# Altium project radxa_cm3_io_board_v1330.PrjPcb (part 3 of 4)

## Sheet 14.SchDoc
size 297 x 209 mm
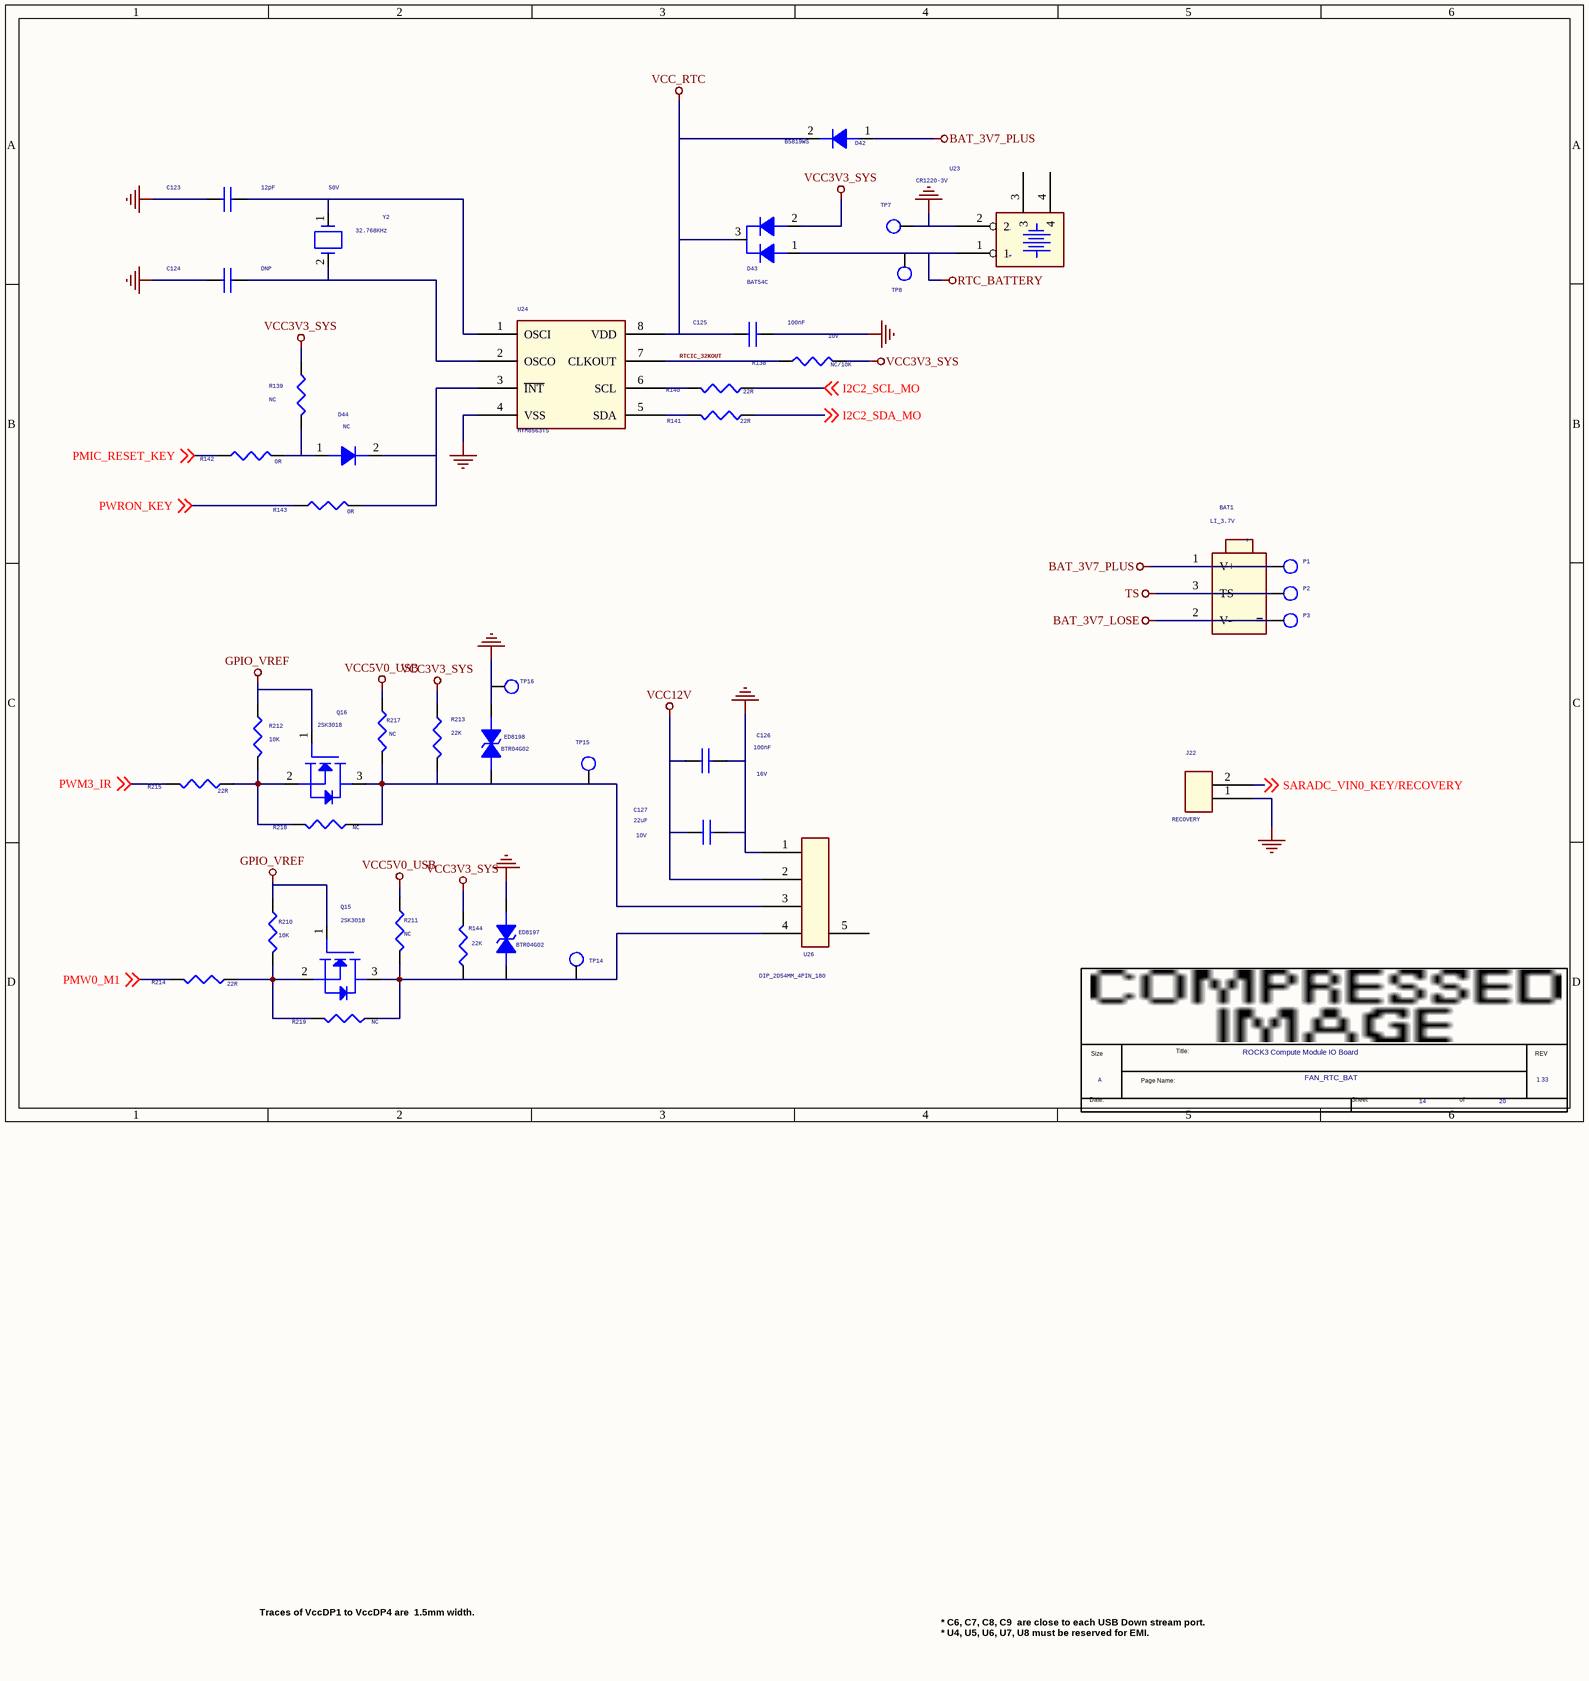
[diagram p12: 14.SchDoc]

### Parts
(Parts that share a designator on the sheet are numbered #1, #2 ... from top to bottom, then left to right.)
*#13  Page Count: 20  Page Number: 14  Page Size: A  Title: ROCK3 Compute Module IO Board  RevCode: 1.33  Doc: FAN_RTC_BAT  (hidden comment: radxa_1010)  (graphical)
BAT1  LI_3.7V  [SMD-3P-1.25]
C123  12pF  Voltage: 50V  [C0402]
C124  DNP  [C0402]
C125  100nF  Voltage: 10V  [C0402]
C126  100nF  Voltage: 16V  [C0402]
C127  22uF  Voltage: 10V  [C0603]
D42  B5819WS  [SOD_323]
D43  BAT54C  [SOT_23]
D44  NC  [SOD323]
ED8197  BTR04G02  [ESD0402_1xD5]
ED8198  BTR04G02  [ESD0402_1xD5]
J22  RECOVERY  [DIP2PIN-2P54MM]
P1  TEST  [TEST]  (value not drawn)
P2  TEST  [TEST]  (value not drawn)
P3  TEST  [TEST]  (value not drawn)
Q15  2SK3018  [SOT23]
Q16  2SK3018  [SOT23]
R138  NC/10K  [R0402]
R139  NC  [R0402]
R140  22R  [R0402]
R141  22R  [R0402]
R142  0R  [R0402]
R143  0R  [R0402]
R144  22K  [R0402]
R210  10K  [R0402]
R211  NC  [R0402]
R212  10K  [R0402]
R213  22K  [R0402]
R214  22R  [R0402]
R215  22R  [R0402]
R217  NC  [R0402]
R218  NC  [R0402]
R219  NC  [R0402]
TP7  TP_0.7  [TEST]  (value not drawn)
TP8  TP_0.7  [TEST]  (value not drawn)
TP14  TP_1.0  [TEST]  (value not drawn)
TP15  TP_1.0  [TEST]  (value not drawn)
TP16  TP_1.0  [TEST]  (value not drawn)
U23  CR1220-3V  [BATTERY-20MM]
U24  HYM8563TS  [MSOP8]
U26  DIP_2D54MM_4PIN_180  [470531000_4PIN]
Y2  32.768KHz  [CRY-3215]

### Nets
BAT_3V7_LOSE: BAT1.2(V-) P3.1
BAT_3V7_PLUS: BAT1.1(V+) D42.1(A) P1.1
GND: C123.2 C124.2 C125.2 C126.2 C127.2 ED8197.1 ED8198.1 J22.1 TP7.1 TP16.1 U23.2 U24.4(VSS) U26.1
GPIO_VREF: Q15.1(GATE) Q16.1(GATE) R210.1 R212.1
RTC_BATTERY: D43.1(A1) TP8.1 U23.1
TS: BAT1.3(TS) P2.1
VCC3V3_SYS: D43.2(A2) R138.2 R139.1 R144.1 R213.1
VCC5V0_USB: R211.1 R217.1
VCC12V: C126.1 C127.1 U26.2
VCC_RTC: C125.1 D42.2(K) D43.3(K) U24.8(VDD)
I2C2_SCL_MO: R140.1 ; off-sheet I2C2_SCL_MO
I2C2_SDA_MO: R141.1 ; off-sheet I2C2_SDA_MO
PMIC_RESET_KEY: R142.1 ; off-sheet PMIC_RESET_KEY
PMW0_M1: R214.2 ; off-sheet PMW0_M1
PWM3_IR: R215.2 ; off-sheet PWM3_IR
PWRON_KEY: R143.1 ; off-sheet PWRON_KEY
RTCIC_32KOUT: R138.1 U24.7(CLKOUT)
SARADC_VIN0_KEY/RECOVERY: J22.2 ; off-sheet SARADC_VIN0_KEY/RECOVERY
NetC123_1: C123.1 U24.1(OSCI) Y2.1
NetC124_1: C124.1 U24.2(OSCO) Y2.2
NetD44_1: D44.1(A) R139.2 R142.2
NetD44_2: D44.2(K) R143.2 U24.3(~{INT})
NetED8197_2: ED8197.2 Q15.3(DRAIN) R144.2 R211.2 R219.1 TP14.1 U26.4
NetED8198_2: ED8198.2 Q16.3(DRAIN) R213.2 R217.2 R218.1 TP15.1 U26.3
NetQ15_2: Q15.2(SOURCE) R210.2 R214.1 R219.2
NetQ16_2: Q16.2(SOURCE) R212.2 R215.1 R218.2
NetR140_2: R140.2 U24.6(SCL)
NetR141_2: R141.2 U24.5(SDA)

Not connected (* = marked no-connect by the designer): U23 3 4; U26 5

### Notes on the sheet
- Traces of VccDP1 to VccDP4 are  1.5mm width.
- * C6, C7, C8, C9  are close to each USB Down stream port.
  * U4, U5, U6, U7, U8 must be reserved for EMI.
- (in symbol BATTERY_1) +; -
- (in symbol CON_BATTERY-20MM_0) -; +
- (in symbol radxa_1010) Title:; Size; REV; Page Name:; Date:; Sheet; of

### Library data of the parts
BAT1 = BATTERY_1
C123 = CAP NP_0: cap,12.00pF,+/-5%,50V,C0G,C0402; Manufacturer PN: C1005C0G1H120J050BA; Manufacturer: TDK; Tolerance: 5%; Priority: A; Dielectric: C0G; Created by: JJJ; Part Type: C0402; RK PN: C1005C0G1H120J050BA
C124 = CAP NP_0: Did Not Place.; RK PN: DNPC0402; Priority: A; Part Type: DNP; Manufacturer PN: DNPC0402; Created by: JJJ
C125 = CAP NP_0: cap,100.00nF,+/-10%,10V,X5R,C0402; Manufacturer PN: C1005X5R1A104K050BA; Manufacturer: TDK; C_Voltage: 6.3V; Tolerance: 10%; Priority: A; Number: 37; Dielectric: X5R; Created by: JJJ; Part Type: C0402; RK PN: C1005X5R1A104K050BA
C126 = CAP NP_0: cap,100.00nF,+/-10%,16V,X5R,C0402; Manufacturer PN: C1005X5R1C104K050BA; Manufacturer: TDK; Tolerance: 10%; Priority: A; Dielectric: X5R; Created by: JJJ; Part Type: C0402; RK PN: C1005X5R1C104K050BA
C127 = CAP NP_0: cap,22.00uF,+/-10%,10V,X5R,C0805; Manufacturer PN: C2012X5R1A226K125AB; Manufacturer: TDK; Tolerance: 10%; Priority: A; Dielectric: X5R; Created by: JJJ; Part Type: C0805; RK PN: C2012X5R1A226K125AB
D42 D44 = DIODE_Dup2: Schottky Barrier，B5819WS SOD-323; Manufacturer: 长电; Priority: A; RK PN: B5819WS; Part Type: Schottky rectifier; Manufacturer PN: B5819WS; Created by: JJJ
D43 = DIODE Double: Dual Schottky barrier，BAT54C SOT-23 Schottky Barrier; Manufacturer: 长电; Priority: A; RK PN: BAT54C; Part Type: Schottky rectifier; Manufacturer PN: BAT54C; Created by: JJJ
ED8197 = DIODE BI_DIR TRIG_0: 1-Line, Bi-directional, Transient Voltage Suppressors.17.5pF.; Manufacturer: WillSemi(韦尔半导体); RK PN: ESD5451N; Priority: A; Part Type: ESD_TVS; Manufacturer PN: ESD5451N; Created by: JJJ
ED8198 = DIODE BI_DIR TRIG_0: 1-Line, Bi-directional, Transient Voltage Suppressors.17.5pF.; Manufacturer PN: ESD5451N; Manufacturer: WillSemi(韦尔半导体); Priority: A; Created by: JJJ; Part Type: ESD_TVS; RK PN: ESD5451N
J22 = CON2
P1-P3 = TESTPOINT1
Q15 Q16 = MOSFET N: NMOS,2SK3018,SOT_323,Id=0.1A,Vds=30V; Manufacturer: ROHM; Pd: 0.2W; Vgsth: 1.5V; VDS: 30V; Vgs: 20V; Id_max: 0.1A; Priority: A; Rds: 5ohm; Created by: JJJ; Manufacturer PN: 2SK3018; Part Type: NMOS; RK PN: 2SK3018
R138 R142 R143 = RESISTOR_0: 通用厚膜电阻,10K,+/-5%,R0402,1/16W.; Manufacturer PN: RC0402JR-0710KL; Manufacturer: YAGEO; Tolerance: 5%; option: DNP; Wattage: 1/16W; Priority: A; Created by: YTL; Part Type: 通用厚膜电阻; RK PN: RC0402JR-0710KL
R139 = RESISTOR_0: 通用厚膜电阻,10K,+/-5%,R0402,1/16W.; Manufacturer: YAGEO; Tolerance: 5%; RK PN: RC0402JR-0710KL; Priority: A; Wattage: 1/16W; option: DNP; Part Type: 通用厚膜电阻; Manufacturer PN: RC0402JR-0710KL; Created by: YTL
R140 R141 R214 R215 R218 = RESISTOR_0: 通用厚膜电阻,47K,+/-5%,R0402,1/16W.; Manufacturer: YAGEO; Tolerance: 5%; RK PN: RC0402JR-0747KL; Priority: A; Wattage: 1/16W; Part Type: 通用厚膜电阻; Manufacturer PN: RC0402JR-0747KL; Created by: YTL
R144 = RESISTOR_0: 通用厚膜电阻,47K,+/-5%,R0402,1/16W.; Manufacturer PN: RC0402JR-0747KL; Manufacturer: YAGEO; Tolerance: 1%; Wattage: 0402; Priority: A; Created by: YTL; Part Type: 通用厚膜电阻; RK PN: RC0402JR-0747KL
R210 R212 = RESISTOR_0: 通用厚膜电阻,10K,+/-5%,R0402,1/16W.; Manufacturer PN: RC0402JR-0710KL; Manufacturer: YAGEO; Tolerance: 5%; Wattage: 1/16W; Priority: A; Created by: YTL; Part Type: 通用厚膜电阻; RK PN: RC0402JR-0710KL
R211 R213 R217 = RESISTOR_0: 通用厚膜电阻,1K5,+/-5%,R0402,1/16W.; Manufacturer: YAGEO; Tolerance: 5%; RK PN: RC0402JR-071K5L; Priority: A; Wattage: 1/16W; Part Type: 通用厚膜电阻; Manufacturer PN: RC0402JR-071K5L; Created by: YTL
R219 = RESISTOR_0: 通用厚膜电阻,47K,+/-5%,R0402,1/16W.; Manufacturer PN: RC0402JR-0747KL; Manufacturer: YAGEO; Tolerance: 5%; Wattage: 1/16W; Priority: A; Created by: YTL; Part Type: 通用厚膜电阻; RK PN: RC0402JR-0747KL
TP7 TP8 = TP: Test Point 0.7mm; RK PN: TESTPOINT_0R7; Priority: A; Part Type: TP; Created by: JJJ
TP14 TP16 = TP: Test Point 1.0mm; Priority: A; RK PN: TESTPOINT_1R0; Created by: CZD; Part Type: TP
TP15 = TP: Test Point 1.0mm; RK PN: TESTPOINT_1R0; Priority: A; Part Type: TP; Created by: CZD
U23 = CON_BATTERY-20MM_0
U24 = RTC_HYM8563: I2C Real Time Clock/Calendar; Manufacturer: Haoyu（昊昱微电子）; Priority: A; Created by: JJJ; Manufacturer PN: HYM8563TS; Part Type: RTC; RK PN: HYM8563TS
U26 = CON3_1
Y2 = CRYSTAL_2P_0: 无源晶振，32.768KHz，MC-146,±20ppm，12.5pF，Hosonic; Manufacturer PN: ETDE32.768W125BMPF; Manufacturer: Hosonic(鸿星电子); Priority: A; Created by: JJJ; Part Type: CRYSTAL; RK PN: ETDE32.768W125BMPF
*#13 = radxa_1010: Page Create Date: March  8, 1995

## Sheet 15.SchDoc
size 420 x 297 mm
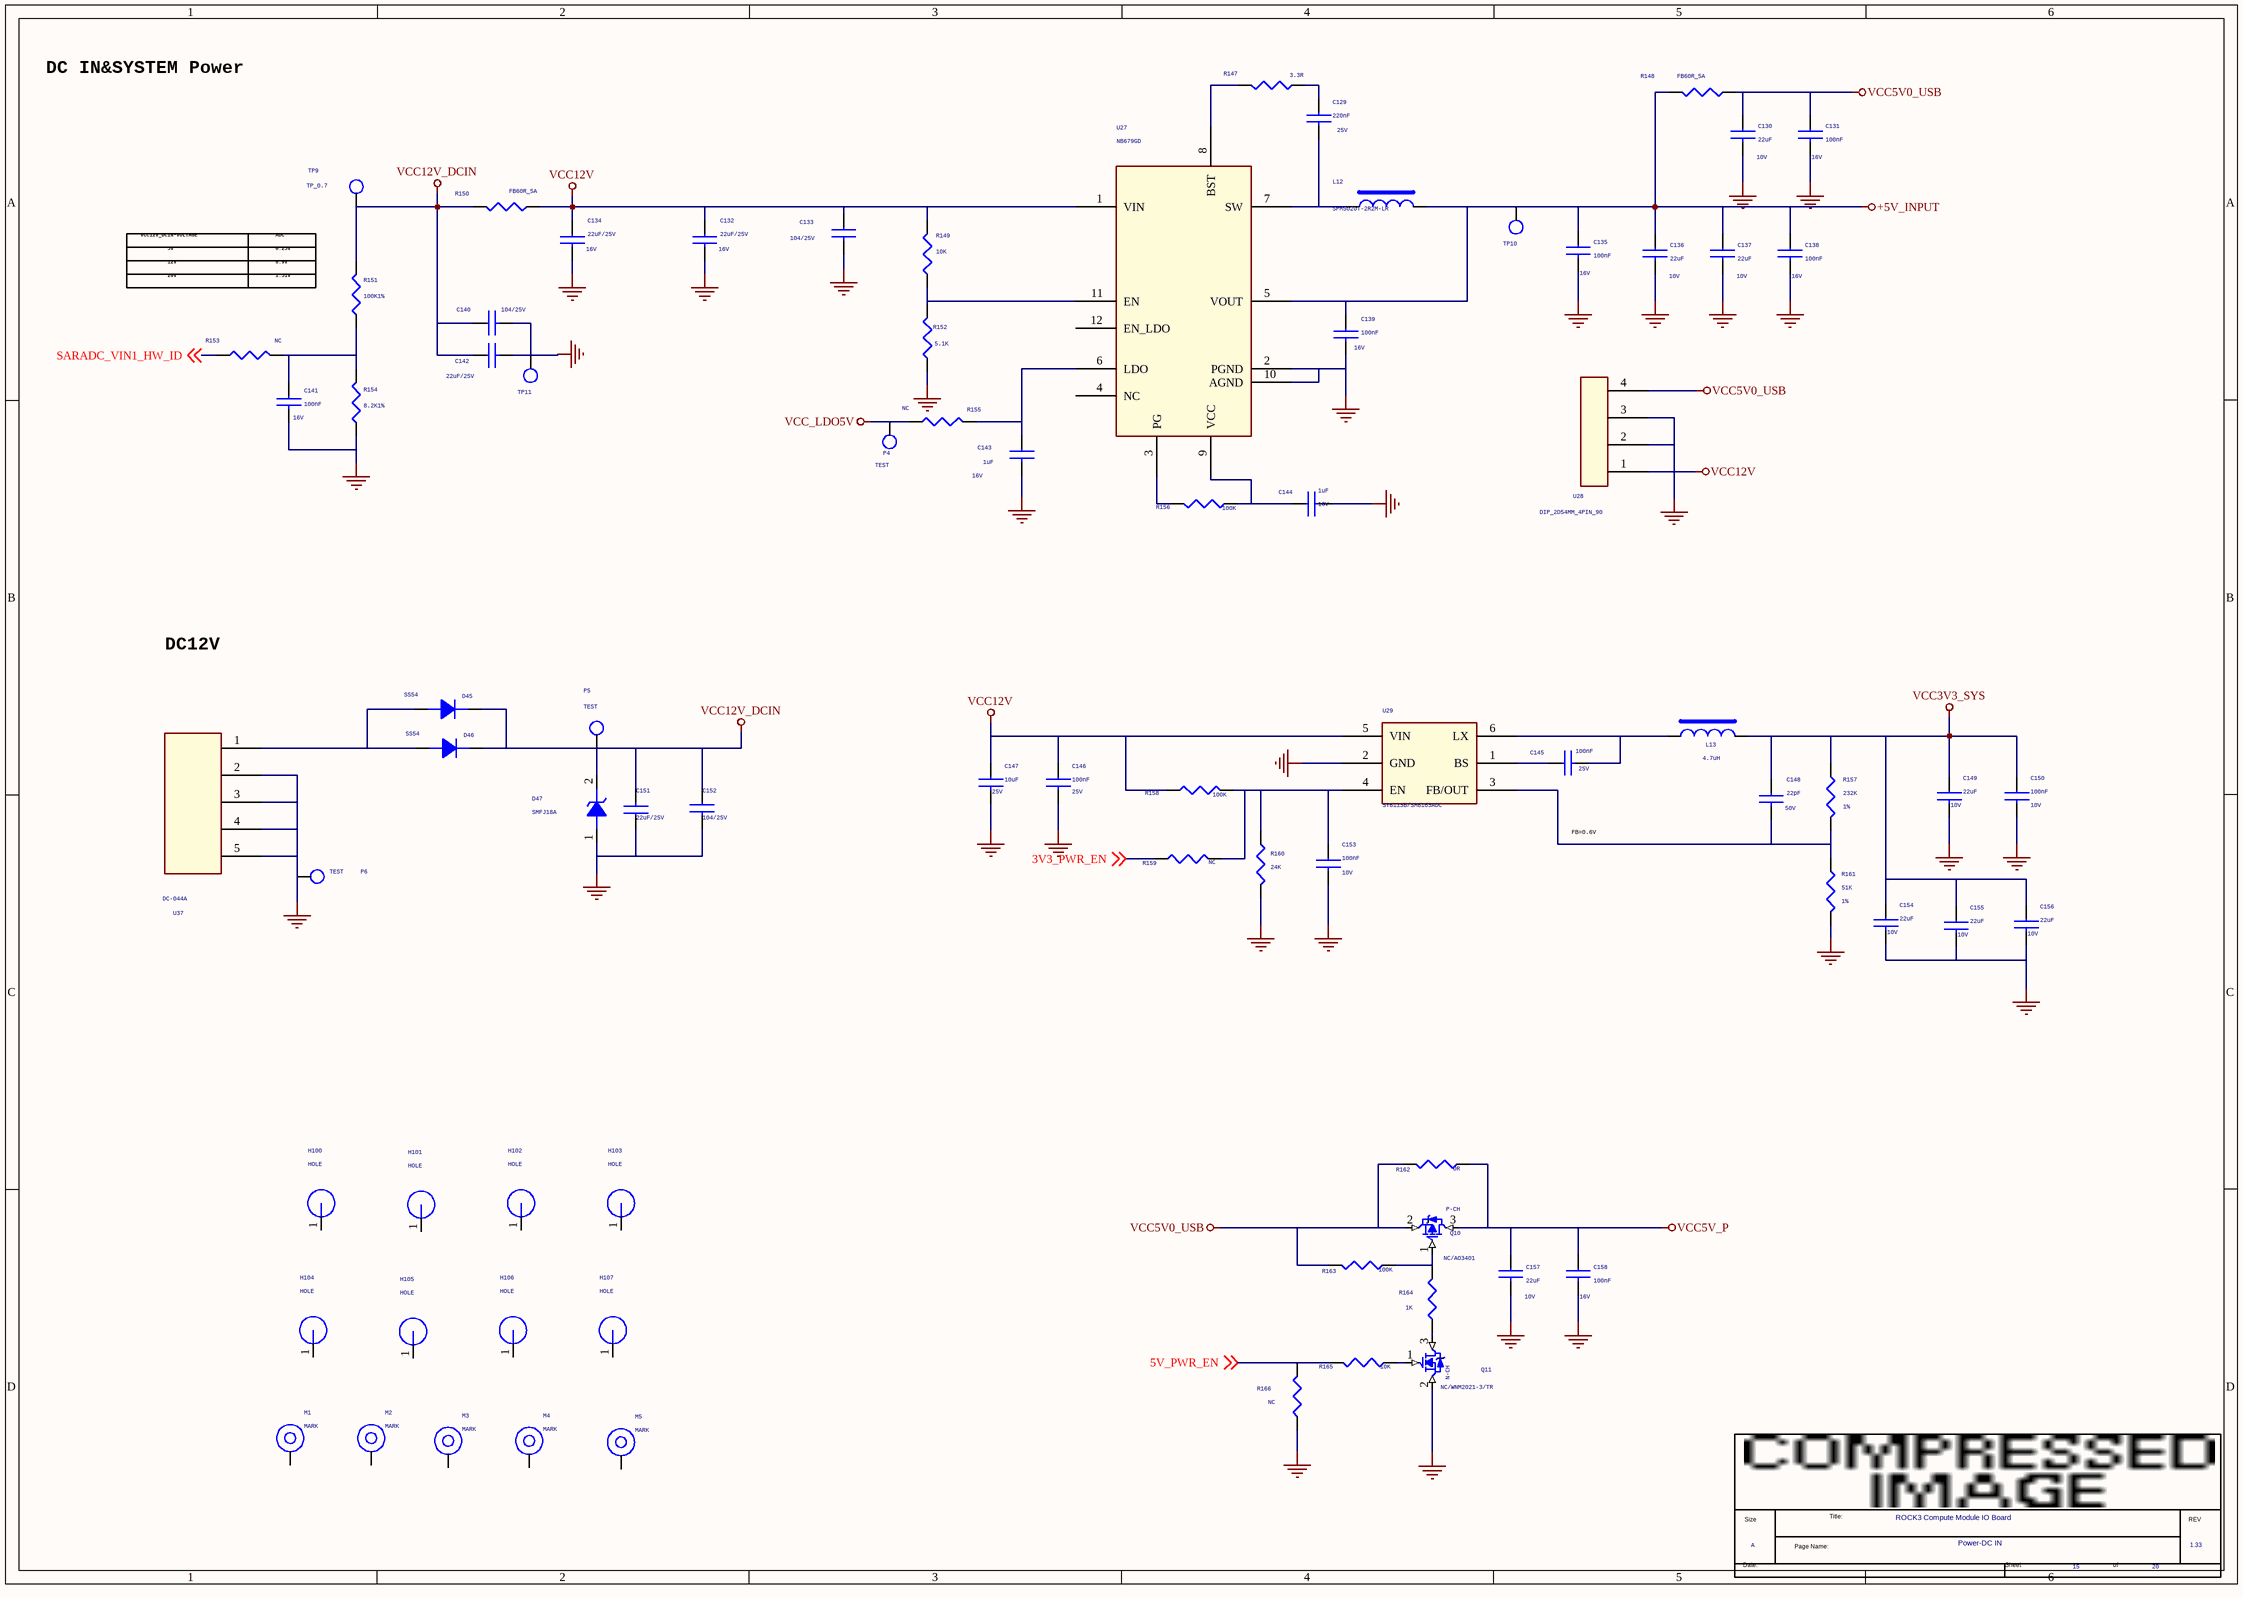
[diagram p13: 15.SchDoc]

### Parts
(Parts that share a designator on the sheet are numbered #1, #2 ... from top to bottom, then left to right.)
*#14  Page Count: 20  Page Number: 15  Page Size: A  Title: ROCK3 Compute Module IO Board  RevCode: 1.33  Doc: Power-DC IN  (hidden comment: radxa_1010)  (graphical)
C129  220nF  Voltage: 25V  [C0402]
C130  22uF  Voltage: 10V  [C0603]
C131  100nF  Voltage: 16V  [C0402]
C132  22uF/25V  Voltage: 16V  [C0805]
C133  104/25V  [C0402]
C134  22uF/25V  Voltage: 16V  [C0805]
C135  100nF  Voltage: 16V  [C0402]
C136  22uF  Voltage: 10V  [C0603]
C137  22uF  Voltage: 10V  [C0603]
C138  100nF  Voltage: 16V  [C0402]
C139  100nF  Voltage: 16V  [C0402]
C140  104/25V  [C0402]
C141  100nF  Voltage: 16V  [C0402]
C142  22uF/25V  [C0805]
C143  1uF  Voltage: 16V  [C0402]
C144  1uF  Voltage: 16V  [C0402]
C145  100nF  Voltage: 25V  [C0402]
C146  100nF  Voltage: 25V  [C0402]
C147  10uF  Voltage: 25V  [C1206]
C148  22pF  Voltage: 50V  [C0402]
C149  22uF  Voltage: 10V  [C0805]
C150  100nF  Voltage: 10V  [C0402]
C151  22uF/25V  [C0805]
C152  104/25V  [C0402]
C153  100nF  Voltage: 10V  [C0402]
C154  22uF  Voltage: 10V  [C0805]
C155  22uF  Voltage: 10V  [C0805]
C156  22uF  Voltage: 10V  [C0805]
C157  22uF  Voltage: 10V  [C0603]
C158  100nF  Voltage: 16V  [C0402]
D45  SS54  [DO_214AC]
D46  SS54  [DO_214AC]
D47  SMFJ18A  [SOD_123]
H100  HOLE  [H3.8MM]
H101  HOLE  [H3.8MM]
H102  HOLE  [H3.8MM]
H103  HOLE  [H3.8MM]
H104  HOLE  [H3.8MM]
H105  HOLE  [H3.8MM]
H106  HOLE  [H3.8MM]
H107  HOLE  [H3.8MM]
L12  SPM5020T-2R2M-LR  [IND-5020]
L13  4.7uH  [IND-5020]
M1  MARK  [MARK]
M2  MARK  [MARK]
M3  MARK  [MARK]
M4  MARK  [MARK]
M5  MARK  [MARK]
P4  TEST  [TEST]
P5  TEST  [TEST]
P6  TEST  [TEST]
Q10  NC/AO3401  [S0T-23]
Q11  NC/WNM2021-3/TR  [S0T-23]
R147  3.3R  [R0402]
R148  FB60R_5A  [R1206]
R149  10K  [R0402]
R150  FB60R_5A  [R1206]
R151  100K1%  [R0402]
R152  5.1K  [R0402]
R153  NC  [R0402]
R154  8.2K1%  [R0402]
R155  NC  [R0402]
R156  100K  [R0402]
R157  232K  Tolerance: 1%  [R0402]
R158  100K  [R0402]
R159  NC  [R0402]
R160  24K  [R0402]
R161  51K  Tolerance: 1%  [R0402]
R162  0R  [R0603]
R163  100K  [R0402]
R164  1K  [R0402]
R165  10K  [R0402]
R166  NC  [R0402]
TP9  TP_0.7  [TEST]
TP10  TP_0.7  [TEST]  (value not drawn)
TP11  TP_0.7  [TEST]  (value not drawn)
U27  NB679GD  [QFN12_3R00X2R00X0R90]
U28  DIP_2D54MM_4PIN_90  [XIAO_4PIN_2D54]
U29  SY8113B/SM8103ADC  [SOT_23_6]
U37  DC-044A  [DC-044A]

### Nets
+5V_INPUT: C135.1 C136.1 C137.1 C138.1 C139.1 L12.2 R148.2 TP10.1 U27.5(VOUT)
GND: C130.2 C131.2 C132.2 C133.2 C134.2 C135.2 C136.2 C137.2 C138.2 C139.2 C140.2 C141.2 C142.2 C143.2 C144.2 C146.2 C147.2 C149.2 C150.2 C151.1 C152.2 C153.2 C154.2 C155.2 C156.2 C157.2 C158.2 D47.1(ANODE) P6.1 Q11.2(S) R152.1 R154.1 R160.2 R161.2 R166.2 TP11.1 U27.2(PGND) U27.10(AGND) U28.2 U28.3 U29.2(GND) U37.2 U37.3 U37.4 U37.5
VCC3V3_SYS: C148.1 C149.1 C150.1 C154.1 C155.1 C156.1 L13.2 R157.1
VCC5V0_USB: C130.1 C131.1 Q10.2(S) R148.1 R162.2 R163.2 U28.4
VCC5V_P: C157.1 C158.1 Q10.3(D) R162.1
VCC12V: C132.1 C133.1 C134.1 C146.1 C147.1 R149.2 R150.1 R158.1 U27.1(VIN) U28.1 U29.5(VIN)
VCC12V_DCIN: C140.1 C142.1 C151.2 C152.1 D45.2(K) D46.2(K) D47.2(CATHODE) P5.1 R150.2 R151.2 TP9.1
VCC_LDO5V: P4.1 R155.1
3V3_PWR_EN: R159.1 ; off-sheet 3V3_PWR_EN
5V_PWR_EN: R165.2 R166.1 ; off-sheet 5V_PWR_EN
SARADC_VIN1_HW_ID: R153.1 ; off-sheet SARADC_VIN1_HW_ID
NetC129_1: C129.1 R147.2
NetC129_2: C129.2 L12.1 U27.7(SW)
NetC141_1: C141.1 R151.1 R153.2 R154.2
NetC143_1: C143.1 R155.2 U27.6(LDO)
NetC144_1: C144.1 R156.2 U27.9(VCC)
NetC145_1: C145.1 U29.1(BS)
NetC145_2: C145.2 L13.1 U29.6(LX)
NetC148_2: C148.2 R157.2 R161.1 U29.3(FB/OUT)
NetC153_1: C153.1 R158.2 R159.2 R160.1 U29.4(EN)
NetD45_1: D45.1(A) D46.1(A) U37.1
NetQ10_1: Q10.1(G) R163.1 R164.1
NetQ11_1: Q11.1(G) R165.1
NetQ11_3: Q11.3(D) R164.2
NetR147_1: R147.1 U27.8(BST)
NetR149_1: R149.1 R152.2 U27.11(EN)
NetR156_1: R156.1 U27.3(PG)

Not connected (* = marked no-connect by the designer): H100 1; H101 1; H102 1; H103 1; H104 1; H105 1; H106 1; H107 1; M1 1; M2 1; M3 1; M4 1; M5 1; U27 4(NC) 12(EN_LDO)

### Notes on the sheet
- DC IN&SYSTEM Power
- VCC12V_DCIN-VOLTAGE
- 5V
- 12V
- ADC
- 0.25V
- 0.9V
- 20V
- 1.51V
- DC12V
- FB=0.6V
- (in symbol N-MOSFET) N-CH
- (in symbol P-MOSFET) P-CH
- (in symbol radxa_1010) Size; Title:; REV; Page Name:; Date:; Sheet; of

### Library data of the parts
C129 = CAP NP_0: cap,220.00nF,+/-10%,25V,X5R,C0402; Manufacturer PN: C1005X5R1E224K050BC; Manufacturer: TDK; Tolerance: 10%; Priority: A; Dielectric: X5R; Created by: JJJ; Part Type: C0402; RK PN: C1005X5R1E224K050BC
C130 C136 C137 = CAP NP_0: as C127 on sheet 14; Dielectric: X5R; Created by: JJJ; Part Type: C0805; RK PN: C2012X5R1A226K125AB
C131 C135 C138 C141 C158 = CAP NP_0: cap,100.00nF,+/-10%,16V,X5R,C0402; Manufacturer: TDK; RK PN: C1005X5R1C104K050BA; Priority: A; Tolerance: 10%; Dielectric: X5R; Part Type: C0402; Manufacturer PN: C1005X5R1C104K050BA; Created by: JJJ
C132 = CAP NP_0: cap,10.00uF,+/-10%,16V,X5R,C0805; Manufacturer: TDK; RK PN: C2012X5R1C106K125AC; Priority: A; Tolerance: 10%; Dielectric: X5R; Part Type: C0805; Manufacturer PN: C2012X5R1C106K125AC; Created by: JJJ
C133 C140 = CAP NP_0: cap,1.00uF,+/-10%,16V,X5R,C0402; Manufacturer PN: C1005X5R1C105K050BC; Manufacturer: TDK; Voltage: 25V; Tolerance: 10%; Priority: A; Dielectric: X5R; Created by: JJJ; Part Type: C0402; RK PN: C1005X5R1C105K050BC
C134 C142 = CAP NP_0: cap,10.00uF,+/-10%,16V,X5R,C0805; Manufacturer PN: C2012X5R1C106K125AC; Manufacturer: TDK; Tolerance: 10%; Priority: A; Dielectric: X5R; Created by: JJJ; Part Type: C0805; RK PN: C2012X5R1C106K125AC
  C142: Voltage: 16V
C139 = CAP NP_0: as C126 on sheet 14; Dielectric: X5R; Created by: JJJ; Part Type: C0402; RK PN: C1005X5R1C104K050BA
C143 C144 = CAP NP_0: cap,1.00uF,+/-10%,16V,X5R,C0402; Manufacturer PN: C1005X5R1C105K050BC; Manufacturer: TDK; Tolerance: 10%; Priority: A; Dielectric: X5R; Created by: JJJ; Part Type: C0402; RK PN: C1005X5R1C105K050BC
C145 = CAP NP_0: cap,100.00nF,+/-10%,25V,X5R,C0402; Manufacturer: TDK; Number: 37; RK PN: C1005X5R1E104K050BC; Priority: A; Tolerance: 10%; C_Voltage: 6.3V; Dielectric: X5R; Part Type: C0402; Manufacturer PN: C1005X5R1E104K050BC; Created by: JJJ
C146 = CAP NP_0: cap,100.00nF,+/-10%,25V,X5R,C0402; Manufacturer PN: C1005X5R1E104K050BC; Manufacturer: TDK; Tolerance: 10%; Priority: A; Dielectric: X5R; Created by: JJJ; Part Type: C0402; RK PN: C1005X5R1E104K050BC
C147 = CAP NP_0: cap,10.00uF,+/-10%,25V,X5R,C1206; Manufacturer: TDK; RK PN: C3216X5R1E106K085AC; Priority: A; C_Voltage: 6.3V; Tolerance: 10%; Dielectric: X5R; Part Type: C1206; Manufacturer PN: C3216X5R1E106K085AC; Created by: JJJ
C148 = CAP NP_0: cap,22.00pF,+/-5%,50V,C0G,C0402; Manufacturer: TDK; RK PN: C1005C0G1H220J050BA; Priority: A; Tolerance: 5%; Dielectric: C0G; Part Type: C0402; Manufacturer PN: C1005C0G1H220J050BA; Created by: JJJ
C149 C155 = CAP NP_0: cap,22.00uF,+/-10%,10V,X5R,C0805; Manufacturer: TDK; RK PN: C2012X5R1A226K125AB; Priority: A; C_Voltage: 6.3V; Tolerance: 10%; Dielectric: X5R; Part Type: C0805; Manufacturer PN: C2012X5R1A226K125AB; Created by: JJJ
C150 = CAP NP_0: cap,100.00nF,+/-10%,10V,X5R,C0402; Manufacturer: TDK; Number: 37; RK PN: C1005X5R1A104K050BA; Priority: A; Tolerance: 10%; C_Voltage: 6.3V; Dielectric: X5R; Part Type: C0402; Manufacturer PN: C1005X5R1A104K050BA; Created by: JJJ
C151 = CAP NP_4
C152 = CAP NP_Dup1: CAP,MLCC,1nF,+/-10%,X5R,6.3V,SMD0402; MARK: 22P; ROOM: USB+5V
C153 = CAP NP_0: as C125 on sheet 14; Dielectric: X5R; Created by: JJJ; Part Type: C0402; RK PN: C1005X5R1A104K050BA
C154 C156 = CAP NP_0: cap,22.00uF,+/-10%,10V,X5R,C0805; Manufacturer PN: C2012X5R1A226K125AB; Manufacturer: TDK; Tolerance: 10%; C_Voltage: 6.3V; Priority: A; Dielectric: X5R; Created by: JJJ; Part Type: C0805; RK PN: C2012X5R1A226K125AB
C157 = CAP NP_0: cap,22.00uF,+/-10%,10V,X5R,C0805; Manufacturer: TDK; RK PN: C2012X5R1A226K125AB; Priority: A; Tolerance: 10%; Dielectric: X5R; Part Type: C0805; Manufacturer PN: C2012X5R1A226K125AB; Created by: JJJ
D45 = DIODE_Dup1: Schottky Barrier，SS32 DO214AC; Manufacturer PN: SS32; Manufacturer: 星海; Priority: A; ROOM: CHG; Created by: JJJ; Part Type: Schottky rectifier; RK PN: SS32
D46 = DIODE_Dup1: Schottky Barrier，SS32 DO214AC; Manufacturer: 星海; ROOM: CHG; RK PN: SS32; Priority: A; Part Type: Schottky rectifier; Manufacturer PN: SS32; Created by: JJJ
D47 = DIODE ZENER1: 1-Line, Uni-directional, Transient Voltage Suppressor; Manufacturer PN: ESD5621W-2/TR; Manufacturer: WillSemi(韦尔半导体); Priority: A; Created by: JJJ; Part Type: ESD_TVS; RK PN: ESD5621W-2/TR
H100-H103 = HOLE: 直径3.5mm hole; RK PN: HOLE_3R50; Priority: A; Part Type: HOLE; Created by: CZD
H104-H107 = HOLE: 直径3.5mm hole; Priority: A; RK PN: HOLE_3R50; Created by: CZD; Part Type: HOLE
L12 = INDUCTORS OF FERRITE
L13 = INDUCTORS OF FERRITE_Dup1: Power Inductor,4.7uH,0.2,IND_606045; Manufacturer PN: SWPA6045S4R7MT; Manufacturer: sunlord; Isat: 4.97A; DC Resistor: 0.02ohm; Resonace frequency: 24M; Irms: 3.3A; Tolerance: 20%; Priority: A; Created by: YWQ; Part Type: POWER_IND; RK PN: SWPA6045S4R7MT
M1 M4 = MARK: MARK Symble; Priority: A; RK PN: MARK01; Created by: JJJ; Part Type: MARK
M2 M3 M5 = MARK: MARK Symble; RK PN: MARK01; Priority: A; Part Type: MARK; Created by: JJJ
P4-P6 = TESTPOINT1
Q10 = P-MOSFET: SANZ_P/N: SK2301; Part Type: MOS管
Q11 = N-MOSFET: SANZ_P/N: SK2300; Part Type: MOS管
R147 = RESISTOR_0: 通用厚膜电阻,3R3,+/-5%,R0402,1/16W.; Manufacturer PN: RC0402JR-073R3L; Manufacturer: YAGEO; Tolerance: 5%; Wattage: 1/16W; Priority: A; Created by: YTL; Part Type: 通用厚膜电阻; RK PN: RC0402JR-073R3L
R148 R150 = R_0
R149 = RESISTOR_0: as R210 on sheet 14; Created by: YTL; Part Type: 通用厚膜电阻; RK PN: RC0402JR-0710KL
R151 R155 = RESISTOR_2: 通用厚膜电阻,10K,+/-5%,R0402,1/16W.; Manufacturer: YAGEO; Tolerance: 5%; RK PN: RC0402JR-0710KL; Priority: A; Wattage: 1/16W; Part Type: 通用厚膜电阻; Manufacturer PN: RC0402JR-0710KL; Created by: YTL
R152 = RESISTOR_0: 通用厚膜电阻,10K,+/-5%,R0402,1/16W.; Manufacturer: YAGEO; Tolerance: 5%; RK PN: RC0402JR-0710KL; Priority: A; Wattage: 1/16W; Part Type: 通用厚膜电阻; Manufacturer PN: RC0402JR-0710KL; Created by: YTL
R153 R154 = RESISTOR_2: 通用厚膜电阻,10K,+/-5%,R0402,1/16W.; Manufacturer PN: RC0402JR-0710KL; Manufacturer: YAGEO; Tolerance: 5%; Wattage: 1/16W; Priority: A; Created by: YTL; Part Type: 通用厚膜电阻; RK PN: RC0402JR-0710KL
R156 = RESISTOR_0: 通用厚膜电阻,100K,+/-5%,R0402,1/16W.; Manufacturer: YAGEO; Tolerance: 5%; RK PN: RC0402JR-07100KL; Priority: A; Wattage: 1/16W; Part Type: 通用厚膜电阻; Manufacturer PN: RC0402JR-07100KL; Created by: YTL
R157 = RESISTOR_0: 通用厚膜电阻,232K,+/-1%,R0402,1/16W.; Manufacturer: YAGEO; RK PN: RC0402FR-07232KL; Priority: A; Wattage: 1/16W; Part Type: 通用厚膜电阻; Manufacturer PN: RC0402FR-07232KL; Created by: YTL
R158 R159 = RESISTOR_0: 通用厚膜电阻,100K,+/-5%,R0402,1/16W.; Manufacturer PN: RC0402JR-07100KL; Manufacturer: YAGEO; Tolerance: 5%; Wattage: 1/16W; Priority: A; Created by: YTL; Part Type: 通用厚膜电阻; RK PN: RC0402JR-07100KL
R160 = RESISTOR_0: 通用厚膜电阻,24K,+/-5%,R0402,1/16W.; Manufacturer: YAGEO; Tolerance: 5%; RK PN: RC0402JR-0724KL; Priority: A; Wattage: 1/16W; Part Type: 通用厚膜电阻; Manufacturer PN: RC0402JR-0724KL; Created by: YTL
R161 = RESISTOR_0: 通用厚膜电阻,49K9,+/-1%,R0402,1/16W.; Manufacturer: YAGEO; RK PN: RC0402FR-0749K9L; Priority: A; Wattage: 1/16W; Part Type: 通用厚膜电阻; Manufacturer PN: RC0402FR-0749K9L; Created by: YTL
R162 R163 R165 = RESISTOR_1: RES,thick film,47KOhm,+/-5%,1/16W,SMD0402
R164 R166 = RESISTOR_0_Dup1: RES,thick film,47KOhm,+/-5%,1/16W,SMD0402; MARK: 51K
TP9 TP10 = TP: as TP7 on sheet 14; Part Type: TP; Created by: JJJ
TP11 = TP: Test Point 0.7mm; Priority: A; RK PN: TESTPOINT_0R7; Created by: JJJ; Part Type: TP
U27 = DCDC_NB679: 26 V, Low Iq, High Current, Fixed 5 V-8 A Synchronous Buck Converter with 100 mA LDO;; Manufacturer: MPS （美国芯源）; RK PN: NB679GD; Priority: A; Part Type: DCDC; Manufacturer PN: NB679GD; Created by: JJJ
U28 = CON3_2
U29 = DCDC_SY8113: Manufacturer: Silergy（矽力杰）; Priority: A; RK PN: SY8113B; Part Type: DCDC; Manufacturer PN: SY8113B; Created by: JJJ
U37 = CON3_6
*#14 = radxa_1010: Page Create Date: March  8, 1995

## Sheet 16.SchDoc
size 297 x 209 mm
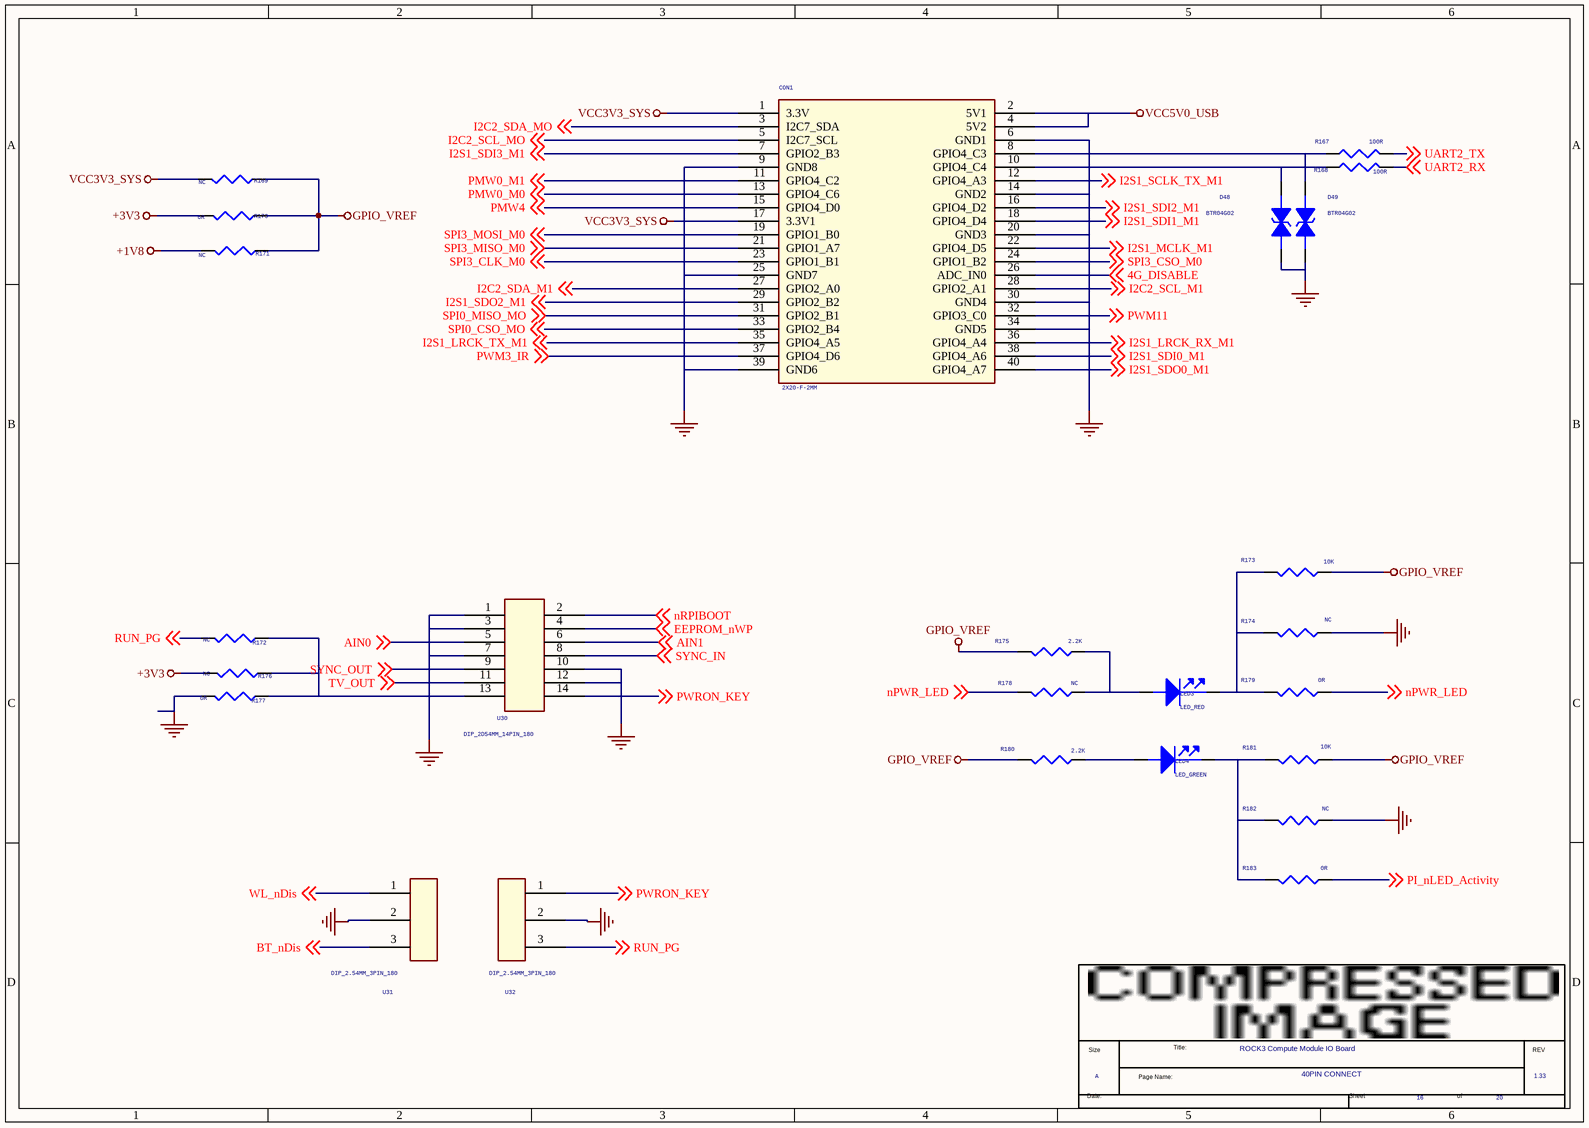
[diagram p14: 16.SchDoc]

### Parts
(Parts that share a designator on the sheet are numbered #1, #2 ... from top to bottom, then left to right.)
*#15  Page Count: 20  Page Number: 16  Page Size: A  Title: ROCK3 Compute Module IO Board  RevCode: 1.33  Doc: 40PIN CONNECT  (hidden comment: radxa_1010)  (graphical)
CON1  2X20-F-2MM  [DIP40PIN_2D54MM]
D48  BTR04G02  [ESD0402_1xD5]
D49  BTR04G02  [ESD0402_1xD5]
LED3  LED_RED  [LED0603]
LED4  LED_GREEN  [LED0603]
R167  100R  [R0402]
R168  100R  [R0402]
R169  NC  [R0402]
R170  0R  [R0402]
R171  NC  [R0402]
R172  NC  [R0402]
R173  10K  [R0402]
R174  NC  [R0402]
R175  2.2K  [R0402]
R176  NC  [R0402]
R177  0R  [R0402]
R178  NC  [R0402]
R179  0R  [R0402]
R180  2.2K  [R0402]
R181  10K  [R0402]
R182  NC  [R0402]
R183  0R  [R0402]
U30  DIP_2D54MM_14PIN_180  [DIP_14PIN-2_54MM]
U31  DIP_2.54MM_3PIN_180  [DIP3_1X2P54]
U32  DIP_2.54MM_3PIN_180  [DIP3_1X2P54]

### Nets
+1V8: R171.2
+3V3: R170.2 R176.2
GND: CON1.6(GND1) CON1.9(GND8) CON1.14(GND2) CON1.20(GND3) CON1.25(GND7) CON1.30(GND4) CON1.34(GND5) CON1.39(GND6) D48.1 D49.1 R174.2 R177.2 R182.2 U30.1 U30.3 U30.7 U30.10 U30.12 U31.2 U32.2
GPIO_VREF: R169.1 R170.1 R171.1 R173.2 R175.1 R180.1 R181.2
VCC3V3_SYS: CON1.1(3.3V) CON1.17(3.3V1) R169.2
VCC5V0_USB: CON1.2(5V1) CON1.4(5V2)
4G_DISABLE: CON1.26(ADC_IN0) ; off-sheet 4G_DISABLE
AIN0: U30.5 ; off-sheet AIN0
AIN1: U30.6 ; off-sheet AIN1
BT_nDis: U31.3 ; off-sheet BT_nDis
EEPROM_nWP: U30.4 ; off-sheet EEPROM_nWP
I2C2_SCL_M1: CON1.28(GPIO2_A1) ; off-sheet I2C2_SCL_M1
I2C2_SCL_MO: CON1.5(I2C7_SCL) ; off-sheet I2C2_SCL_MO
I2C2_SDA_M1: CON1.27(GPIO2_A0) ; off-sheet I2C2_SDA_M1
I2C2_SDA_MO: CON1.3(I2C7_SDA) ; off-sheet I2C2_SDA_MO
I2S1_LRCK_RX_M1: CON1.36(GPIO4_A4) ; off-sheet I2S1_LRCK_RX_M1
I2S1_LRCK_TX_M1: CON1.35(GPIO4_A5) ; off-sheet I2S1_LRCK_TX_M1
I2S1_MCLK_M1: CON1.22(GPIO4_D5) ; off-sheet I2S1_MCLK_M1
I2S1_SCLK_TX_M1: CON1.12(GPIO4_A3) ; off-sheet I2S1_SCLK_TX_M1
I2S1_SDI0_M1: CON1.38(GPIO4_A6) ; off-sheet I2S1_SDI0_M1
I2S1_SDI1_M1: CON1.18(GPIO4_D4) ; off-sheet I2S1_SDI1_M1
I2S1_SDI2_M1: CON1.16(GPIO4_D2) ; off-sheet I2S1_SDI2_M1
I2S1_SDI3_M1: CON1.7(GPIO2_B3) ; off-sheet I2S1_SDI3_M1
I2S1_SDO0_M1: CON1.40(GPIO4_A7) ; off-sheet I2S1_SDO0_M1
I2S1_SDO2_M1: CON1.29(GPIO2_B2) ; off-sheet I2S1_SDO2_M1
nPWR_LED: R178.1 R179.2 ; off-sheet nPWR_LED
nRPIBOOT: U30.2 ; off-sheet nRPIBOOT
PI_nLED_Activity: R183.2 ; off-sheet PI_nLED_Activity
PMW0_M0: CON1.13(GPIO4_C6) ; off-sheet PMW0_M0
PMW0_M1: CON1.11(GPIO4_C2) ; off-sheet PMW0_M1
PMW4: CON1.15(GPIO4_D0) ; off-sheet PMW4
PWM3_IR: CON1.37(GPIO4_D6) ; off-sheet PWM3_IR
PWM11: CON1.32(GPIO3_C0) ; off-sheet PWM11
PWRON_KEY: U30.14 U32.1 ; off-sheet PWRON_KEY
RUN_PG: R172.2 U32.3 ; off-sheet RUN_PG
SPI0_CSO_MO: CON1.33(GPIO2_B4) ; off-sheet SPI0_CSO_MO
SPI0_MISO_MO: CON1.31(GPIO2_B1) ; off-sheet SPI0_MISO_MO
SPI3_CLK_M0: CON1.23(GPIO1_B1) ; off-sheet SPI3_CLK_M0
SPI3_CSO_M0: CON1.24(GPIO1_B2) ; off-sheet SPI3_CSO_M0
SPI3_MISO_M0: CON1.21(GPIO1_A7) ; off-sheet SPI3_MISO_M0
SPI3_MOSI_M0: CON1.19(GPIO1_B0) ; off-sheet SPI3_MOSI_M0
SYNC_IN: U30.8 ; off-sheet SYNC_IN
SYNC_OUT: U30.9 ; off-sheet SYNC_OUT
TV_OUT: U30.11 ; off-sheet TV_OUT
UART2_RX: R168.2 ; off-sheet UART2_RX
UART2_TX: R167.2 ; off-sheet UART2_TX
WL_nDis: U31.1 ; off-sheet WL_nDis
NetCON1_8: CON1.8(GPIO4_C3) D49.2 R167.1
NetCON1_10: CON1.10(GPIO4_C4) D48.2 R168.1
NetLED3_1: LED3.1(ANODE) R175.2 R178.2
NetLED3_2: LED3.2(CATHODE) R173.1 R174.1 R179.1
NetLED4_1: LED4.1(ANODE) R180.2
NetLED4_2: LED4.2(CATHODE) R181.1 R182.1 R183.1
NetR172_1: R172.1 R176.1 R177.1 U30.13

### Notes on the sheet
- (in symbol radxa_1010) Size; Title:; REV; Page Name:; Date:; Sheet; of

### Library data of the parts
CON1 = CN_0
D48 = DIODE BI_DIR TRIG_0: 1-Line, Bi-directional, Transient Voltage Suppressors.17.5pF.; Manufacturer PN: ESD5451N; Manufacturer: WillSemi(韦尔半导体); OPTION: DNP; Priority: A; Created by: JJJ; Part Type: ESD_TVS; RK PN: ESD5451N
D49 = DIODE BI_DIR TRIG_0: 1-Line, Bi-directional, Transient Voltage Suppressors.17.5pF.; Manufacturer: WillSemi(韦尔半导体); RK PN: ESD5451N; Priority: A; OPTION: DNP; Part Type: ESD_TVS; Manufacturer PN: ESD5451N; Created by: JJJ
LED3 = LED: 贴片LED灯，0603，绿色; Priority: A; RK PN: LED_GREEN; Created by: JJJ; Part Type: LED
LED4 = LED: 贴片LED灯，0603，绿色; Priority: A; Created by: JJJ; Part Type: LED; RK PN: LED_GREEN
R167 R169 R171 R172 R177 = RESISTOR_0: 通用厚膜电阻,100R,+/-5%,R0402,1/16W.; Manufacturer PN: RC0402JR-07100RL; Manufacturer: YAGEO; Tolerance: 5%; Wattage: 1/16W; Priority: A; Created by: YTL; Part Type: 通用厚膜电阻; RK PN: RC0402JR-07100RL
R168 R170 R176 = RESISTOR_0: 通用厚膜电阻,100R,+/-5%,R0402,1/16W.; Manufacturer: YAGEO; Tolerance: 5%; RK PN: RC0402JR-07100RL; Priority: A; Wattage: 1/16W; Part Type: 通用厚膜电阻; Manufacturer PN: RC0402JR-07100RL; Created by: YTL
R173 R180 R181 = RESISTOR_2: 通用厚膜电阻,330R,+/-5%,R0402,1/16W.; Manufacturer PN: RC0402JR-07330RL; Manufacturer: YAGEO; Tolerance: 5%; Wattage: 1/16W; Priority: A; Created by: YTL; Part Type: 通用厚膜电阻; RK PN: RC0402JR-07330RL
R174 R175 R178 R179 R182 R183 = RESISTOR_2: 通用厚膜电阻,330R,+/-5%,R0402,1/16W.; Manufacturer: YAGEO; Tolerance: 5%; RK PN: RC0402JR-07330RL; Priority: A; Wattage: 1/16W; Part Type: 通用厚膜电阻; Manufacturer PN: RC0402JR-07330RL; Created by: YTL
U30 = CON3_0
U31 U32 = CON3_1_Dup1
*#15 = radxa_1010: Page Create Date: March  8, 1995

## Sheet 17.SchDoc
size 386 x 246 mm
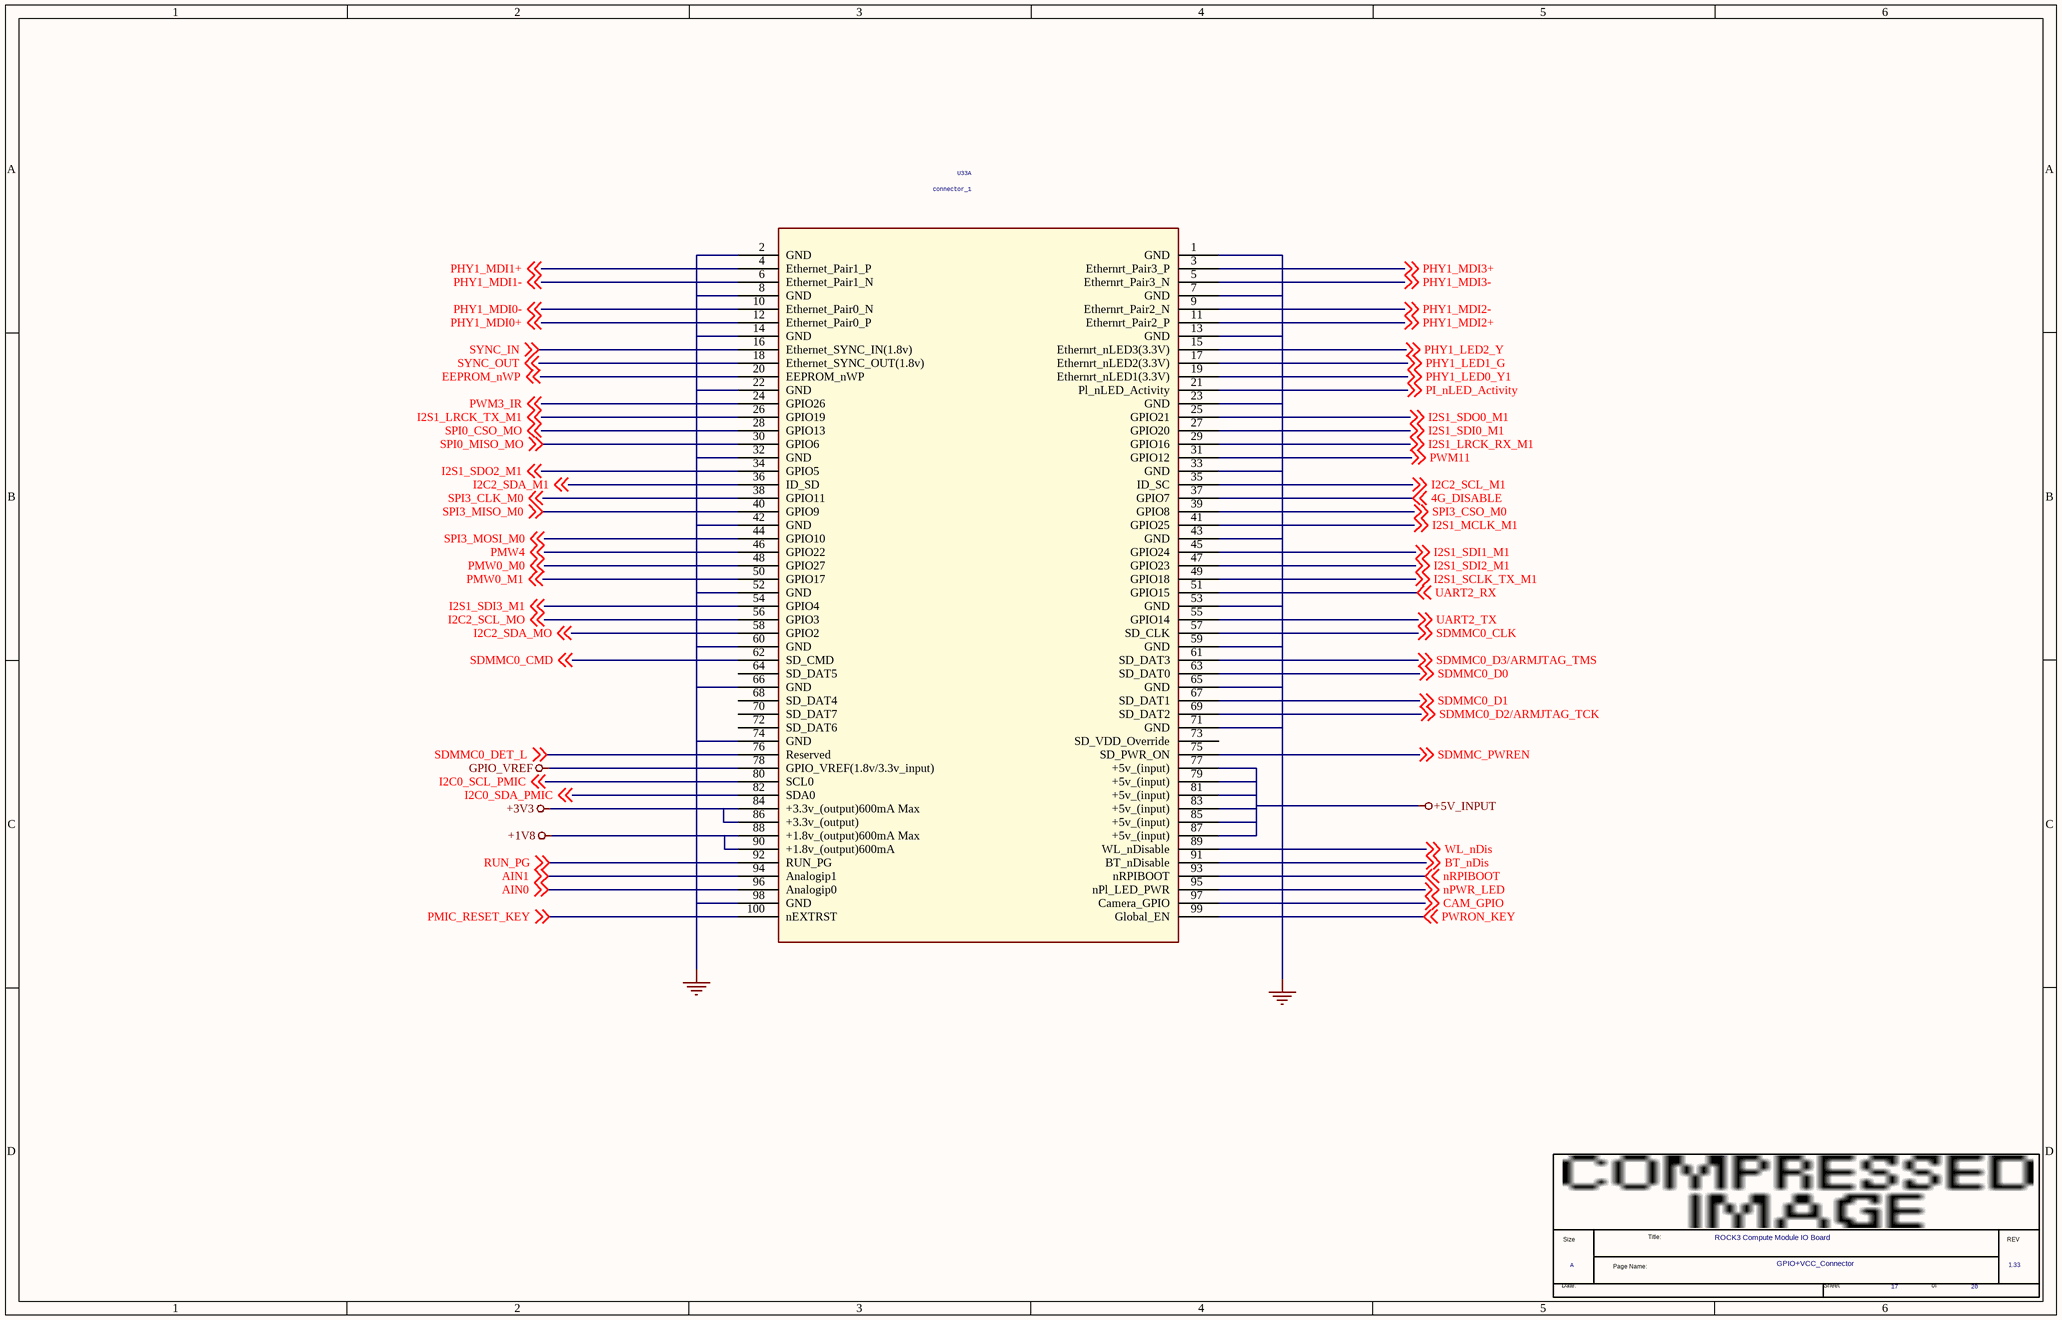
[diagram p15: 17.SchDoc]

### Parts
(Parts that share a designator on the sheet are numbered #1, #2 ... from top to bottom, then left to right.)
*#16  Page Count: 20  Page Number: 17  Page Size: A  Title: ROCK3 Compute Module IO Board  RevCode: 1.33  Doc: GPIO+VCC_Connector  (hidden comment: radxa_1010)  (graphical)
U33  connector_1  [DF40C-200DS-D4-OK]  (part A of 2)

### Nets
+1V8: U33.88(+1.8v_(output)600mA_Max) U33.90(+1.8v_(output)600mA)
+3V3: U33.84(+3.3v_(output)600mA_Max) U33.86(+3.3v_(output))
+5V_INPUT: U33.77(+5v_(input)) U33.79(+5v_(input)) U33.81(+5v_(input)) U33.83(+5v_(input)) U33.85(+5v_(input)) U33.87(+5v_(input))
GND: U33.1(GND) U33.2(GND) U33.7(GND) U33.8(GND) U33.13(GND) U33.14(GND) U33.22(GND) U33.23(GND) U33.32(GND) U33.33(GND) U33.42(GND) U33.43(GND) U33.52(GND) U33.53(GND) U33.59(GND) U33.60(GND) U33.65(GND) U33.66(GND) U33.71(GND) U33.74(GND) U33.98(GND)
GPIO_VREF: U33.78(GPIO_VREF(1.8v/3.3v_input))
4G_DISABLE: U33.37(GPIO7) ; off-sheet 4G_DISABLE
AIN0: U33.96(Analogip0) ; off-sheet AIN0
AIN1: U33.94(Analogip1) ; off-sheet AIN1
BT_nDis: U33.91(BT_nDisable) ; off-sheet BT_nDis
CAM_GPIO: U33.97(Camera_GPIO) ; off-sheet CAM_GPIO
EEPROM_nWP: U33.20(EEPROM_nWP) ; off-sheet EEPROM_nWP
I2C0_SCL_PMIC: U33.80(SCL0) ; off-sheet I2C0_SCL_PMIC
I2C0_SDA_PMIC: U33.82(SDA0) ; off-sheet I2C0_SDA_PMIC
I2C2_SCL_M1: U33.35(ID_SC) ; off-sheet I2C2_SCL_M1
I2C2_SCL_MO: U33.56(GPIO3) ; off-sheet I2C2_SCL_MO
I2C2_SDA_M1: U33.36(ID_SD) ; off-sheet I2C2_SDA_M1
I2C2_SDA_MO: U33.58(GPIO2) ; off-sheet I2C2_SDA_MO
I2S1_LRCK_RX_M1: U33.29(GPIO16) ; off-sheet I2S1_LRCK_RX_M1
I2S1_LRCK_TX_M1: U33.26(GPIO19) ; off-sheet I2S1_LRCK_TX_M1
I2S1_MCLK_M1: U33.41(GPIO25) ; off-sheet I2S1_MCLK_M1
I2S1_SCLK_TX_M1: U33.49(GPIO18) ; off-sheet I2S1_SCLK_TX_M1
I2S1_SDI0_M1: U33.27(GPIO20) ; off-sheet I2S1_SDI0_M1
I2S1_SDI1_M1: U33.45(GPIO24) ; off-sheet I2S1_SDI1_M1
I2S1_SDI2_M1: U33.47(GPIO23) ; off-sheet I2S1_SDI2_M1
I2S1_SDI3_M1: U33.54(GPIO4) ; off-sheet I2S1_SDI3_M1
I2S1_SDO0_M1: U33.25(GPIO21) ; off-sheet I2S1_SDO0_M1
I2S1_SDO2_M1: U33.34(GPIO5) ; off-sheet I2S1_SDO2_M1
nPWR_LED: U33.95(nPl_LED_PWR) ; off-sheet nPWR_LED
nRPIBOOT: U33.93(nRPIBOOT) ; off-sheet nRPIBOOT
PHY1_LED0_Y1: U33.19(Ethernrt_nLED1(3.3V)) ; off-sheet PHY1_LED0_Y1
PHY1_LED1_G: U33.17(Ethernrt_nLED2(3.3V)) ; off-sheet PHY1_LED1_G
PHY1_LED2_Y: U33.15(Ethernrt_nLED3(3.3V)) ; off-sheet PHY1_LED2_Y
PHY1_MDI0+: U33.12(Ethernet_Pair0_P) ; off-sheet PHY1_MDI0+
PHY1_MDI0-: U33.10(Ethernet_Pair0_N) ; off-sheet PHY1_MDI0-
PHY1_MDI1+: U33.4(Ethernet_Pair1_P) ; off-sheet PHY1_MDI1+
PHY1_MDI1-: U33.6(Ethernet_Pair1_N) ; off-sheet PHY1_MDI1-
PHY1_MDI2+: U33.11(Ethernrt_Pair2_P) ; off-sheet PHY1_MDI2+
PHY1_MDI2-: U33.9(Ethernrt_Pair2_N) ; off-sheet PHY1_MDI2-
PHY1_MDI3+: U33.3(Ethernrt_Pair3_P) ; off-sheet PHY1_MDI3+
PHY1_MDI3-: U33.5(Ethernrt_Pair3_N) ; off-sheet PHY1_MDI3-
PI_nLED_Activity: U33.21(Pl_nLED_Activity) ; off-sheet PI_nLED_Activity
PMIC_RESET_KEY: U33.100(nEXTRST) ; off-sheet PMIC_RESET_KEY
PMW0_M0: U33.48(GPIO27) ; off-sheet PMW0_M0
PMW0_M1: U33.50(GPIO17) ; off-sheet PMW0_M1
PMW4: U33.46(GPIO22) ; off-sheet PMW4
PWM3_IR: U33.24(GPIO26) ; off-sheet PWM3_IR
PWM11: U33.31(GPIO12) ; off-sheet PWM11
PWRON_KEY: U33.99(Global_EN) ; off-sheet PWRON_KEY
RUN_PG: U33.92(RUN_PG) ; off-sheet RUN_PG
SDMMC0_CLK: U33.57(SD_CLK) ; off-sheet SDMMC0_CLK
SDMMC0_CMD: U33.62(SD_CMD) ; off-sheet SDMMC0_CMD
SDMMC0_D0: U33.63(SD_DAT0) ; off-sheet SDMMC0_D0
SDMMC0_D1: U33.67(SD_DAT1) ; off-sheet SDMMC0_D1
SDMMC0_D2/ARMJTAG_TCK: U33.69(SD_DAT2) ; off-sheet SDMMC0_D2/ARMJTAG_TCK
SDMMC0_D3/ARMJTAG_TMS: U33.61(SD_DAT3) ; off-sheet SDMMC0_D3/ARMJTAG_TMS
SDMMC0_DET_L: U33.76(Reserved) ; off-sheet SDMMC0_DET_L
SDMMC_PWREN: U33.75(SD_PWR_ON) ; off-sheet SDMMC_PWREN
SPI0_CSO_MO: U33.28(GPIO13) ; off-sheet SPI0_CSO_MO
SPI0_MISO_MO: U33.30(GPIO6) ; off-sheet SPI0_MISO_MO
SPI3_CLK_M0: U33.38(GPIO11) ; off-sheet SPI3_CLK_M0
SPI3_CSO_M0: U33.39(GPIO8) ; off-sheet SPI3_CSO_M0
SPI3_MISO_M0: U33.40(GPIO9) ; off-sheet SPI3_MISO_M0
SPI3_MOSI_M0: U33.44(GPIO10) ; off-sheet SPI3_MOSI_M0
SYNC_IN: U33.16(Ethernet_SYNC_IN(1.8v)) ; off-sheet SYNC_IN
SYNC_OUT: U33.18(Ethernet_SYNC_OUT(1.8v)) ; off-sheet SYNC_OUT
UART2_RX: U33.51(GPIO15) ; off-sheet UART2_RX
UART2_TX: U33.55(GPIO14) ; off-sheet UART2_TX
WL_nDis: U33.89(WL_nDisable) ; off-sheet WL_nDis

Not connected (* = marked no-connect by the designer): U33 64(SD_DAT5) 68(SD_DAT4) 70(SD_DAT7) 72(SD_DAT6) 73(SD_VDD_Override)

### Notes on the sheet
- (in symbol radxa_1010) Title:; Size; REV; Page Name:; Date:; Sheet; of

### Library data of the parts
U33 = HETER_4
*#16 = radxa_1010: Page Create Date: March  8, 1995

## Sheet 18.SchDoc
size 386 x 246 mm
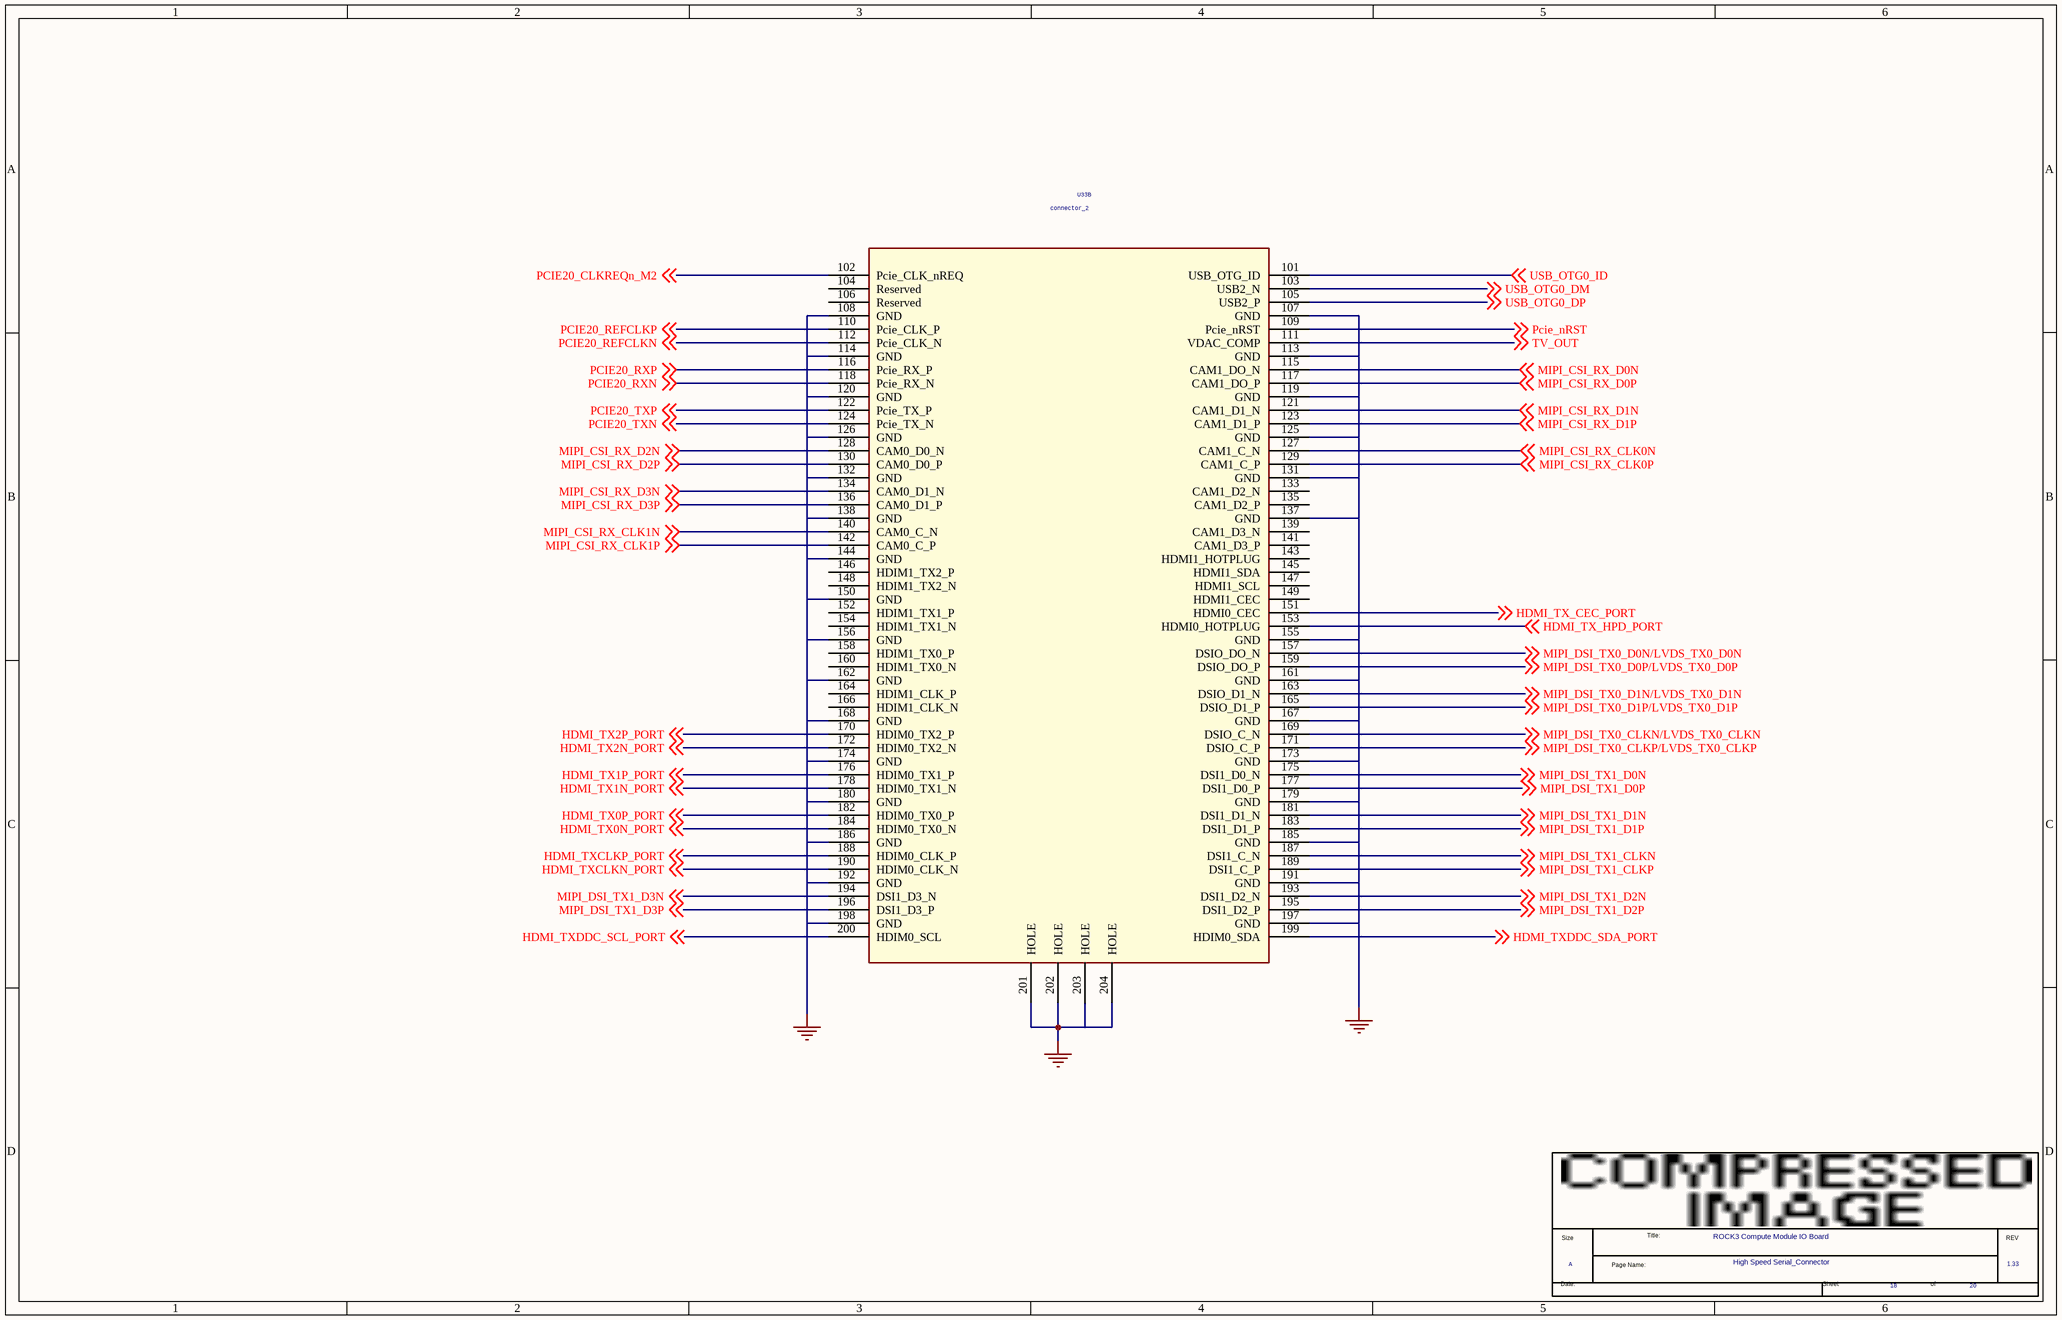
[diagram p16: 18.SchDoc]

### Parts
(Parts that share a designator on the sheet are numbered #1, #2 ... from top to bottom, then left to right.)
*#17  Page Count: 20  Page Number: 18  Page Size: A  Title: ROCK3 Compute Module IO Board  RevCode: 1.33  Doc: High Speed Serial_Connector  (hidden comment: radxa_1010)  (graphical)
U33  connector_2  [DF40C-200DS-D4-OK]  (part B of 2)

### Nets
GND: U33.107(GND) U33.108(GND) U33.113(GND) U33.114(GND) U33.119(GND) U33.120(GND) U33.125(GND) U33.126(GND) U33.131(GND) U33.132(GND) U33.137(GND) U33.138(GND) U33.144(GND) U33.150(GND) U33.155(GND) U33.156(GND) U33.161(GND) U33.162(GND) U33.167(GND) U33.168(GND) U33.173(GND) U33.174(GND) U33.179(GND) U33.180(GND) U33.185(GND) U33.186(GND) U33.191(GND) U33.192(GND) U33.197(GND) U33.198(GND) U33.201(HOLE) U33.202(HOLE) U33.203(HOLE) U33.204(HOLE)
HDMI_TX0N_PORT: U33.184(HDIM0_TX0_N) ; off-sheet HDMI_TX0N_PORT
HDMI_TX0P_PORT: U33.182(HDIM0_TX0_P) ; off-sheet HDMI_TX0P_PORT
HDMI_TX1N_PORT: U33.178(HDIM0_TX1_N) ; off-sheet HDMI_TX1N_PORT
HDMI_TX1P_PORT: U33.176(HDIM0_TX1_P) ; off-sheet HDMI_TX1P_PORT
HDMI_TX2N_PORT: U33.172(HDIM0_TX2_N) ; off-sheet HDMI_TX2N_PORT
HDMI_TX2P_PORT: U33.170(HDIM0_TX2_P) ; off-sheet HDMI_TX2P_PORT
HDMI_TX_CEC_PORT: U33.151(HDMI0_CEC) ; off-sheet HDMI_TX_CEC_PORT
HDMI_TX_HPD_PORT: U33.153(HDMI0_HOTPLUG) ; off-sheet HDMI_TX_HPD_PORT
HDMI_TXCLKN_PORT: U33.190(HDIM0_CLK_N) ; off-sheet HDMI_TXCLKN_PORT
HDMI_TXCLKP_PORT: U33.188(HDIM0_CLK_P) ; off-sheet HDMI_TXCLKP_PORT
HDMI_TXDDC_SCL_PORT: U33.200(HDIM0_SCL) ; off-sheet HDMI_TXDDC_SCL_PORT
HDMI_TXDDC_SDA_PORT: U33.199(HDIM0_SDA) ; off-sheet HDMI_TXDDC_SDA_PORT
MIPI_CSI_RX_CLK0N: U33.127(CAM1_C_N) ; off-sheet MIPI_CSI_RX_CLK0N
MIPI_CSI_RX_CLK0P: U33.129(CAM1_C_P) ; off-sheet MIPI_CSI_RX_CLK0P
MIPI_CSI_RX_CLK1N: U33.140(CAM0_C_N) ; off-sheet MIPI_CSI_RX_CLK1N
MIPI_CSI_RX_CLK1P: U33.142(CAM0_C_P) ; off-sheet MIPI_CSI_RX_CLK1P
MIPI_CSI_RX_D0N: U33.115(CAM1_DO_N) ; off-sheet MIPI_CSI_RX_D0N
MIPI_CSI_RX_D0P: U33.117(CAM1_DO_P) ; off-sheet MIPI_CSI_RX_D0P
MIPI_CSI_RX_D1N: U33.121(CAM1_D1_N) ; off-sheet MIPI_CSI_RX_D1N
MIPI_CSI_RX_D1P: U33.123(CAM1_D1_P) ; off-sheet MIPI_CSI_RX_D1P
MIPI_CSI_RX_D2N: U33.128(CAM0_D0_N) ; off-sheet MIPI_CSI_RX_D2N
MIPI_CSI_RX_D2P: U33.130(CAM0_D0_P) ; off-sheet MIPI_CSI_RX_D2P
MIPI_CSI_RX_D3N: U33.134(CAM0_D1_N) ; off-sheet MIPI_CSI_RX_D3N
MIPI_CSI_RX_D3P: U33.136(CAM0_D1_P) ; off-sheet MIPI_CSI_RX_D3P
MIPI_DSI_TX0_CLKN/LVDS_TX0_CLKN: U33.169(DSIO_C_N) ; off-sheet MIPI_DSI_TX0_CLKN/LVDS_TX0_CLKN
MIPI_DSI_TX0_CLKP/LVDS_TX0_CLKP: U33.171(DSIO_C_P) ; off-sheet MIPI_DSI_TX0_CLKP/LVDS_TX0_CLKP
MIPI_DSI_TX0_D0N/LVDS_TX0_D0N: U33.157(DSIO_DO_N) ; off-sheet MIPI_DSI_TX0_D0N/LVDS_TX0_D0N
MIPI_DSI_TX0_D0P/LVDS_TX0_D0P: U33.159(DSIO_DO_P) ; off-sheet MIPI_DSI_TX0_D0P/LVDS_TX0_D0P
MIPI_DSI_TX0_D1N/LVDS_TX0_D1N: U33.163(DSIO_D1_N) ; off-sheet MIPI_DSI_TX0_D1N/LVDS_TX0_D1N
MIPI_DSI_TX0_D1P/LVDS_TX0_D1P: U33.165(DSIO_D1_P) ; off-sheet MIPI_DSI_TX0_D1P/LVDS_TX0_D1P
MIPI_DSI_TX1_CLKN: U33.187(DSI1_C_N) ; off-sheet MIPI_DSI_TX1_CLKN
MIPI_DSI_TX1_CLKP: U33.189(DSI1_C_P) ; off-sheet MIPI_DSI_TX1_CLKP
MIPI_DSI_TX1_D0N: U33.175(DSI1_D0_N) ; off-sheet MIPI_DSI_TX1_D0N
MIPI_DSI_TX1_D0P: U33.177(DSI1_D0_P) ; off-sheet MIPI_DSI_TX1_D0P
MIPI_DSI_TX1_D1N: U33.181(DSI1_D1_N) ; off-sheet MIPI_DSI_TX1_D1N
MIPI_DSI_TX1_D1P: U33.183(DSI1_D1_P) ; off-sheet MIPI_DSI_TX1_D1P
MIPI_DSI_TX1_D2N: U33.193(DSI1_D2_N) ; off-sheet MIPI_DSI_TX1_D2N
MIPI_DSI_TX1_D2P: U33.195(DSI1_D2_P) ; off-sheet MIPI_DSI_TX1_D2P
MIPI_DSI_TX1_D3N: U33.194(DSI1_D3_N) ; off-sheet MIPI_DSI_TX1_D3N
MIPI_DSI_TX1_D3P: U33.196(DSI1_D3_P) ; off-sheet MIPI_DSI_TX1_D3P
PCIE20_CLKREQn_M2: U33.102(Pcie_CLK_nREQ) ; off-sheet PCIE20_CLKREQn_M2
PCIE20_REFCLKN: U33.112(Pcie_CLK_N) ; off-sheet PCIE20_REFCLKN
PCIE20_REFCLKP: U33.110(Pcie_CLK_P) ; off-sheet PCIE20_REFCLKP
PCIE20_RXN: U33.118(Pcie_RX_N) ; off-sheet PCIE20_RXN
PCIE20_RXP: U33.116(Pcie_RX_P) ; off-sheet PCIE20_RXP
PCIE20_TXN: U33.124(Pcie_TX_N) ; off-sheet PCIE20_TXN
PCIE20_TXP: U33.122(Pcie_TX_P) ; off-sheet PCIE20_TXP
Pcie_nRST: U33.109(Pcie_nRST) ; off-sheet Pcie_nRST
TV_OUT: U33.111(VDAC_COMP) ; off-sheet TV_OUT
USB_OTG0_DM: U33.103(USB2_N) ; off-sheet USB_OTG0_DM
USB_OTG0_DP: U33.105(USB2_P) ; off-sheet USB_OTG0_DP
USB_OTG0_ID: U33.101(USB_OTG_ID) ; off-sheet USB_OTG0_ID

Not connected (* = marked no-connect by the designer): U33 104(Reserved) 106(Reserved) 133(CAM1_D2_N) 135(CAM1_D2_P) 139(CAM1_D3_N) 141(CAM1_D3_P) 143(HDMI1_HOTPLUG) 145(HDMI1_SDA) 146(HDIM1_TX2_P) 147(HDMI1_SCL) 148(HDIM1_TX2_N) 149(HDMI1_CEC) 152(HDIM1_TX1_P) 154(HDIM1_TX1_N) 158(HDIM1_TX0_P) 160(HDIM1_TX0_N) 164(HDIM1_CLK_P) 166(HDIM1_CLK_N)

### Notes on the sheet
- (in symbol radxa_1010) Size; Title:; REV; Page Name:; Date:; Sheet; of

### Library data of the parts
U33 = HETER_4
*#17 = radxa_1010: Page Create Date: March  8, 1995

## Sheet 19.SchDoc
size 386 x 246 mm
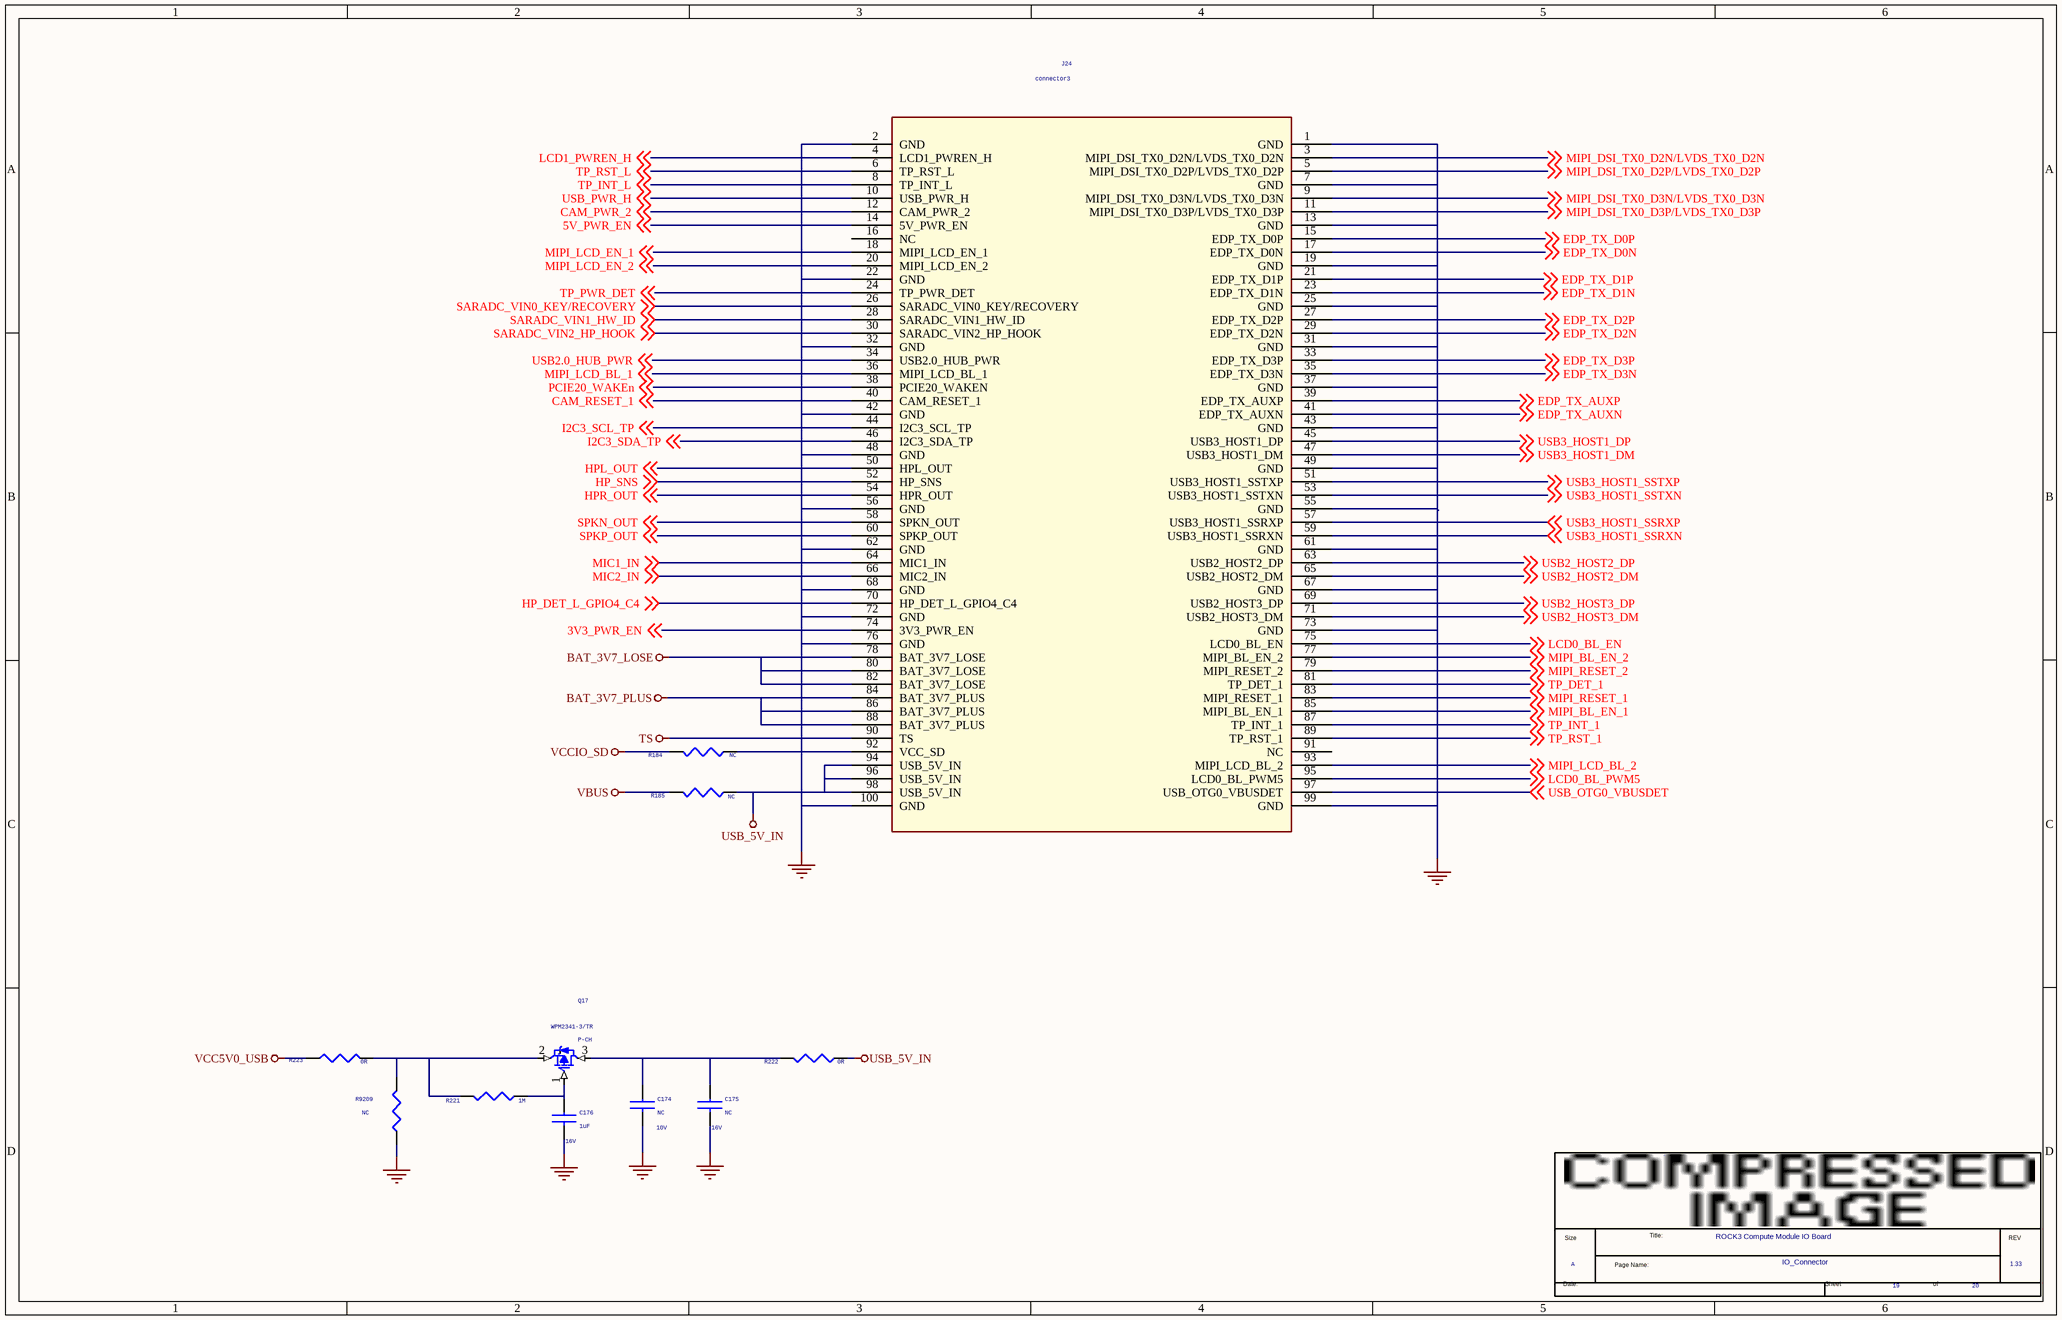
[diagram p17: 19.SchDoc]

### Parts
(Parts that share a designator on the sheet are numbered #1, #2 ... from top to bottom, then left to right.)
*#18  Page Count: 20  Page Number: 19  Page Size: A  Title: ROCK3 Compute Module IO Board  RevCode: 1.33  Doc: IO_Connector  (hidden comment: radxa_1010)  (graphical)
C174  NC  Voltage: 10V  [C0603]
C175  NC  Voltage: 16V  [C0402]
C176  1uF  Voltage: 16V  [C0402]
J24  connector3  [DF40C_100DS]
Q17  WPM2341-3/TR  [S0T-23]
R184  NC  [R0402]
R185  NC  [R0402]
R221  1M  [R0402]
R222  0R  [R0402]
R223  0R  [R0402]
R9209  NC  [R0402]

### Nets
BAT_3V7_LOSE: J24.78(BAT_3V7_LOSE) J24.80(BAT_3V7_LOSE) J24.82(BAT_3V7_LOSE)
BAT_3V7_PLUS: J24.84(BAT_3V7_PLUS) J24.86(BAT_3V7_PLUS) J24.88(BAT_3V7_PLUS)
GND: C174.2 C175.2 C176.2 J24.1(GND) J24.2(GND) J24.7(GND) J24.13(GND) J24.19(GND) J24.22(GND) J24.25(GND) J24.31(GND) J24.32(GND) J24.37(GND) J24.42(GND) J24.43(GND) J24.48(GND) J24.49(GND) J24.55(GND) J24.56(GND) J24.61(GND) J24.62(GND) J24.67(GND) J24.68(GND) J24.72(GND) J24.73(GND) J24.76(GND) J24.99(GND) J24.100(GND) R9209.2
TS: J24.90(TS)
USB_5V_IN: J24.94(USB_5V_IN) J24.96(USB_5V_IN) J24.98(USB_5V_IN) R185.2 R222.2
VBUS: R185.1
VCC5V0_USB: R223.1
VCCIO_SD: R184.1
3V3_PWR_EN: J24.74(3V3_PWR_EN) ; off-sheet 3V3_PWR_EN
5V_PWR_EN: J24.14(5V_PWR_EN) ; off-sheet 5V_PWR_EN
CAM_PWR_2: J24.12(CAM_PWR_2) ; off-sheet CAM_PWR_2
CAM_RESET_1: J24.40(CAM_RESET_1) ; off-sheet CAM_RESET_1
EDP_TX_AUXN: J24.41(EDP_TX_AUXN) ; off-sheet EDP_TX_AUXN
EDP_TX_AUXP: J24.39(EDP_TX_AUXP) ; off-sheet EDP_TX_AUXP
EDP_TX_D0N: J24.17(EDP_TX_D0N) ; off-sheet EDP_TX_D0N
EDP_TX_D0P: J24.15(EDP_TX_D0P) ; off-sheet EDP_TX_D0P
EDP_TX_D1N: J24.23(EDP_TX_D1N) ; off-sheet EDP_TX_D1N
EDP_TX_D1P: J24.21(EDP_TX_D1P) ; off-sheet EDP_TX_D1P
EDP_TX_D2N: J24.29(EDP_TX_D2N) ; off-sheet EDP_TX_D2N
EDP_TX_D2P: J24.27(EDP_TX_D2P) ; off-sheet EDP_TX_D2P
EDP_TX_D3N: J24.35(EDP_TX_D3N) ; off-sheet EDP_TX_D3N
EDP_TX_D3P: J24.33(EDP_TX_D3P) ; off-sheet EDP_TX_D3P
HP_DET_L_GPIO4_C4: J24.70(HP_DET_L_GPIO4_C4) ; off-sheet HP_DET_L_GPIO4_C4
HP_SNS: J24.52(HP_SNS) ; off-sheet HP_SNS
HPL_OUT: J24.50(HPL_OUT) ; off-sheet HPL_OUT
HPR_OUT: J24.54(HPR_OUT) ; off-sheet HPR_OUT
I2C3_SCL_TP: J24.44(I2C3_SCL_TP) ; off-sheet I2C3_SCL_TP
I2C3_SDA_TP: J24.46(I2C3_SDA_TP) ; off-sheet I2C3_SDA_TP
LCD0_BL_EN: J24.75(LCD0_BL_EN) ; off-sheet LCD0_BL_EN
LCD0_BL_PWM5: J24.95(LCD0_BL_PWM5) ; off-sheet LCD0_BL_PWM5
LCD1_PWREN_H: J24.4(LCD1_PWREN_H) ; off-sheet LCD1_PWREN_H
MIC1_IN: J24.64(MIC1_IN) ; off-sheet MIC1_IN
MIC2_IN: J24.66(MIC2_IN) ; off-sheet MIC2_IN
MIPI_BL_EN_1: J24.85(MIPI_BL_EN_1) ; off-sheet MIPI_BL_EN_1
MIPI_BL_EN_2: J24.77(MIPI_BL_EN_2) ; off-sheet MIPI_BL_EN_2
MIPI_DSI_TX0_D2N/LVDS_TX0_D2N: J24.3(MIPI_DSI_TX0_D2N/LVDS_TX0_D2N) ; off-sheet MIPI_DSI_TX0_D2N/LVDS_TX0_D2N
MIPI_DSI_TX0_D2P/LVDS_TX0_D2P: J24.5(MIPI_DSI_TX0_D2P/LVDS_TX0_D2P) ; off-sheet MIPI_DSI_TX0_D2P/LVDS_TX0_D2P
MIPI_DSI_TX0_D3N/LVDS_TX0_D3N: J24.9(MIPI_DSI_TX0_D3N/LVDS_TX0_D3N) ; off-sheet MIPI_DSI_TX0_D3N/LVDS_TX0_D3N
MIPI_DSI_TX0_D3P/LVDS_TX0_D3P: J24.11(MIPI_DSI_TX0_D3P/LVDS_TX0_D3P) ; off-sheet MIPI_DSI_TX0_D3P/LVDS_TX0_D3P
MIPI_LCD_BL_1: J24.36(MIPI_LCD_BL_1) ; off-sheet MIPI_LCD_BL_1
MIPI_LCD_BL_2: J24.93(MIPI_LCD_BL_2) ; off-sheet MIPI_LCD_BL_2
MIPI_LCD_EN_1: J24.18(MIPI_LCD_EN_1) ; off-sheet MIPI_LCD_EN_1
MIPI_LCD_EN_2: J24.20(MIPI_LCD_EN_2) ; off-sheet MIPI_LCD_EN_2
MIPI_RESET_1: J24.83(MIPI_RESET_1) ; off-sheet MIPI_RESET_1
MIPI_RESET_2: J24.79(MIPI_RESET_2) ; off-sheet MIPI_RESET_2
PCIE20_WAKEn: J24.38(PCIE20_WAKEN) ; off-sheet PCIE20_WAKEn
SARADC_VIN0_KEY/RECOVERY: J24.26(SARADC_VIN0_KEY/RECOVERY) ; off-sheet SARADC_VIN0_KEY/RECOVERY
SARADC_VIN1_HW_ID: J24.28(SARADC_VIN1_HW_ID) ; off-sheet SARADC_VIN1_HW_ID
SARADC_VIN2_HP_HOOK: J24.30(SARADC_VIN2_HP_HOOK) ; off-sheet SARADC_VIN2_HP_HOOK
SPKN_OUT: J24.58(SPKN_OUT) ; off-sheet SPKN_OUT
SPKP_OUT: J24.60(SPKP_OUT) ; off-sheet SPKP_OUT
TP_DET_1: J24.81(TP_DET_1) ; off-sheet TP_DET_1
TP_INT_1: J24.87(TP_INT_1) ; off-sheet TP_INT_1
TP_INT_L: J24.8(TP_INT_L) ; off-sheet TP_INT_L
TP_PWR_DET: J24.24(TP_PWR_DET) ; off-sheet TP_PWR_DET
TP_RST_1: J24.89(TP_RST_1) ; off-sheet TP_RST_1
TP_RST_L: J24.6(TP_RST_L) ; off-sheet TP_RST_L
USB2.0_HUB_PWR: J24.34(USB2.0_HUB_PWR) ; off-sheet USB2.0_HUB_PWR
USB2_HOST2_DM: J24.65(USB2_HOST2_DM) ; off-sheet USB2_HOST2_DM
USB2_HOST2_DP: J24.63(USB2_HOST2_DP) ; off-sheet USB2_HOST2_DP
USB2_HOST3_DM: J24.71(USB2_HOST3_DM) ; off-sheet USB2_HOST3_DM
USB2_HOST3_DP: J24.69(USB2_HOST3_DP) ; off-sheet USB2_HOST3_DP
USB3_HOST1_DM: J24.47(USB3_HOST1_DM) ; off-sheet USB3_HOST1_DM
USB3_HOST1_DP: J24.45(USB3_HOST1_DP) ; off-sheet USB3_HOST1_DP
USB3_HOST1_SSRXN: J24.59(USB3_HOST1_SSRXN) ; off-sheet USB3_HOST1_SSRXN
USB3_HOST1_SSRXP: J24.57(USB3_HOST1_SSRXP) ; off-sheet USB3_HOST1_SSRXP
USB3_HOST1_SSTXN: J24.53(USB3_HOST1_SSTXN) ; off-sheet USB3_HOST1_SSTXN
USB3_HOST1_SSTXP: J24.51(USB3_HOST1_SSTXP) ; off-sheet USB3_HOST1_SSTXP
USB_OTG0_VBUSDET: J24.97(USB_OTG0_VBUSDET) ; off-sheet USB_OTG0_VBUSDET
USB_PWR_H: J24.10(USB_PWR_H) ; off-sheet USB_PWR_H
NetC174_1: C174.1 C175.1 Q17.3(D) R222.1
NetC176_1: C176.1 Q17.1(G) R221.1
NetJ24_92: J24.92(VCC_SD) R184.2
NetQ17_2: Q17.2(S) R221.2 R223.2 R9209.1

Not connected (* = marked no-connect by the designer): J24 16(NC) 91(NC)

### Notes on the sheet
- (in symbol P-MOSFET) P-CH
- (in symbol radxa_1010) Size; Title:; REV; Page Name:; Date:; Sheet; of

### Library data of the parts
C174 = CAP NP_0: as C157 on sheet 15; Dielectric: X5R; Part Type: C0805; Manufacturer PN: C2012X5R1A226K125AB; Created by: JJJ
C175 = CAP NP_0: as C131 on sheet 15; Dielectric: X5R; Part Type: C0402; Manufacturer PN: C1005X5R1C104K050BA; Created by: JJJ
C176 = CAP NP_0: as C126 on sheet 14; Dielectric: X5R; Created by: JJJ; Part Type: C0402; RK PN: C1005X5R1C104K050BA
J24 = CN_6
Q17 = P-MOSFET: SANZ_P/N: SK2301; Part Type: MOS管
R184 R222 R223 = RESISTOR_0: 通用厚膜电阻,330R,+/-5%,R0402,1/16W.; Manufacturer PN: RC0402JR-07330RL; Manufacturer: YAGEO; Tolerance: 5%; Wattage: 1/16W; Priority: A; Created by: YTL; Part Type: 通用厚膜电阻; RK PN: RC0402JR-07330RL
R185 = RESISTOR_0: 通用厚膜电阻,330R,+/-5%,R0402,1/16W.; Manufacturer: YAGEO; Tolerance: 5%; RK PN: RC0402JR-07330RL; Priority: A; Wattage: 1/16W; Part Type: 通用厚膜电阻; Manufacturer PN: RC0402JR-07330RL; Created by: YTL
R221 = RESISTOR_1: as R162 on sheet 15
R9209 = RESISTOR_0: as R167 on sheet 16; Created by: YTL; Part Type: 通用厚膜电阻; RK PN: RC0402JR-07100RL
*#18 = radxa_1010: Page Create Date: March  8, 1995

## Sheet 20.SchDoc
size 420 x 297 mm
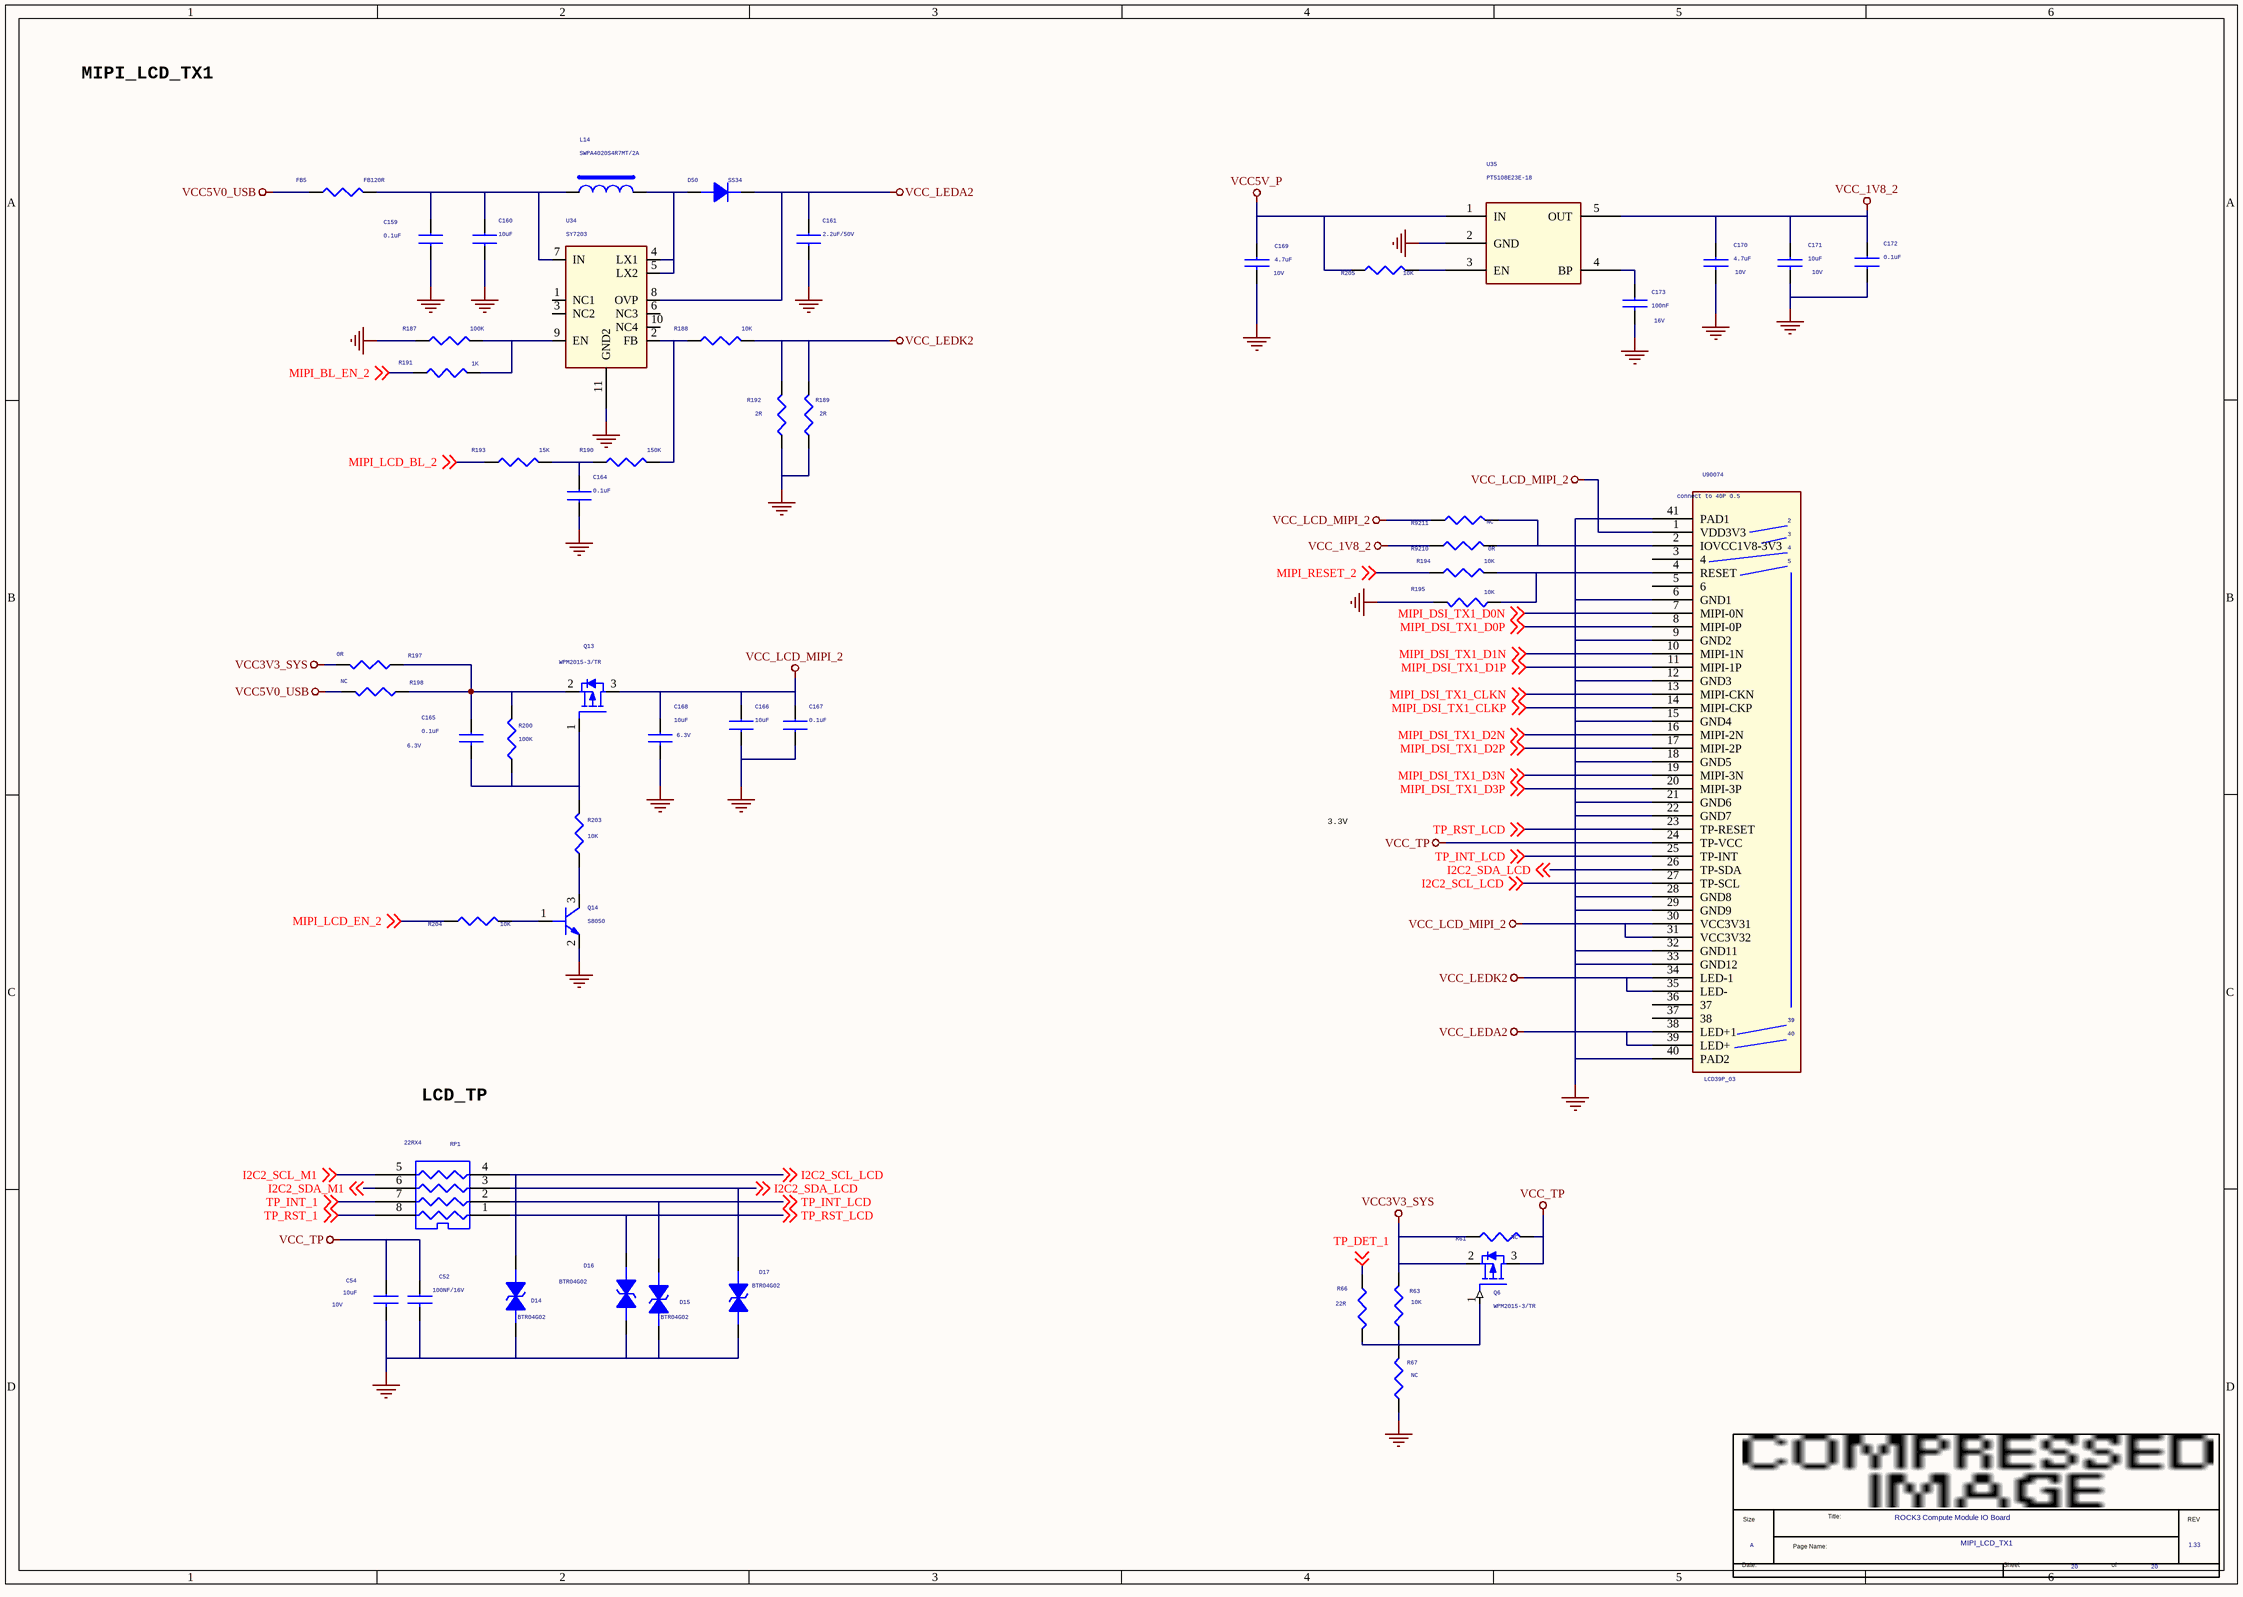
[diagram p18: 20.SchDoc]

### Parts
(Parts that share a designator on the sheet are numbered #1, #2 ... from top to bottom, then left to right.)
*#19  Page Count: 20  Page Size: A  Title: ROCK3 Compute Module IO Board  RevCode: 1.33  Doc: MIPI_LCD_TX1  (hidden comment: radxa_1010)  (graphical)
C52  100NF/16V  [C0402]
C54  10uF  Voltage: 10V  [C0603]
C159  0.1uF  [C0603]
C160  10uF  [C0603]
C161  2.2uF/50V  [C0603]
C164  0.1uF  [C0603]
C165  0.1uF  Voltage: 6.3V  [C0402]
C166  10uF  [C0603]
C167  0.1uF  [C0603]
C168  10uF  Voltage: 6.3V  [C0603]
C169  4.7uF  Voltage: 10V  [C0603]
C170  4.7uF  Voltage: 10V  [C0603]
C171  10uF  Voltage: 10V  [C0603]
C172  0.1uF  [C0603]
C173  100nF  Voltage: 16V  [C0402]
D14  BTR04G02  [ESD0402_1xD5]
D15  BTR04G02  [ESD0402_1xD5]
D16  BTR04G02  [ESD0402_1xD5]
D17  BTR04G02  [ESD0402_1xD5]
D50  SS34  [DO214AC]
FB5  FB120R  [R0603]
L14  SWPA4020S4R7MT/2A  [IND-4X4]
Q6  WPM2015-3/TR  [SOT23]
Q13  WPM2015-3/TR  [SOT23]
Q14  S8050  [SOT23]
R61  NC  [R0402]
R63  10K  [R0402]
R66  22R  [R0402]
R67  NC  [R0402]
R187  100K  [R0402]
R188  10K  [R0402]
R189  2R  [R0805]
R190  150K  [R0402]
R191  1K  [R0402]
R192  2R  [R0805]
R193  15K  [R0402]
R194  10K  [R0402]
R195  10K  [R0402]
R197  0R  [R0603]
R198  NC  [R0603]
R200  100K  [R0402]
R203  10K  [R0402]
R204  10K  [R0402]
R205  10K  [R0402]
R9210  0R  [R0402]
R9211  NC  [R0402]
RP1  22RX4  [RN8P4RC]
U34  SY7203  [QFN8-2X2]
U35  PT5108E23E-18  [SOT25]
U90074  LCD39P_03  [LCD39PIN-ok]

### Nets
GND: C52.2 C54.2 C159.2 C160.2 C161.2 C164.1 C166.2 C167.2 C168.2 C169.2 C170.2 C171.2 C172.2 C173.2 D14.2 D15.2 D16.2 D17.2 Q14.2(EMITTER) R67.1 R187.1 R189.2 R192.2 R195.2 U34.11(GND2) U35.2(GND) U90074.6(GND1) U90074.9(GND2) U90074.12(GND3) U90074.15(GND4) U90074.18(GND5) U90074.21(GND6) U90074.22(GND7) U90074.28(GND8) U90074.29(GND9) U90074.32(GND11) U90074.33(GND12) U90074.40(PAD2) U90074.41(PAD1)
VCC3V3_SYS: Q6.2(SOURCE) R61.1 R63.2 R197.1
VCC5V0_USB: FB5.1 R198.1
VCC5V_P: C169.1 R205.1 U35.1(IN)
VCC_1V8_2: C170.1 C171.1 C172.1 R9210.1 U35.5(OUT)
VCC_LCD_MIPI_2: C166.1 C167.1 C168.1 Q13.3(DRAIN) R9211.1 U90074.1(VDD3V3) U90074.30(VCC3V31) U90074.31(VCC3V32)
VCC_LEDA2: C161.1 D50.2(K) U34.8(OVP) U90074.38(LED+1) U90074.39(LED+)
VCC_LEDK2: R188.2 R189.1 R192.1 U90074.34(LED-1) U90074.35(LED-)
VCC_TP: C52.1 C54.1 Q6.3(DRAIN) R61.2 U90074.24(TP-VCC)
I2C2_SCL_LCD: D14.1 RP1.4(R4) U90074.27(TP-SCL) ; off-sheet I2C2_SCL_LCD
I2C2_SCL_M1: RP1.5(R4) ; off-sheet I2C2_SCL_M1
I2C2_SDA_LCD: D17.1 RP1.3(R3) U90074.26(TP-SDA) ; off-sheet I2C2_SDA_LCD
I2C2_SDA_M1: RP1.6(R3) ; off-sheet I2C2_SDA_M1
MIPI_BL_EN_2: R191.1 ; off-sheet MIPI_BL_EN_2
MIPI_DSI_TX1_CLKN: U90074.13(MIPI-CKN) ; off-sheet MIPI_DSI_TX1_CLKN
MIPI_DSI_TX1_CLKP: U90074.14(MIPI-CKP) ; off-sheet MIPI_DSI_TX1_CLKP
MIPI_DSI_TX1_D0N: U90074.7(MIPI-0N) ; off-sheet MIPI_DSI_TX1_D0N
MIPI_DSI_TX1_D0P: U90074.8(MIPI-0P) ; off-sheet MIPI_DSI_TX1_D0P
MIPI_DSI_TX1_D1N: U90074.10(MIPI-1N) ; off-sheet MIPI_DSI_TX1_D1N
MIPI_DSI_TX1_D1P: U90074.11(MIPI-1P) ; off-sheet MIPI_DSI_TX1_D1P
MIPI_DSI_TX1_D2N: U90074.16(MIPI-2N) ; off-sheet MIPI_DSI_TX1_D2N
MIPI_DSI_TX1_D2P: U90074.17(MIPI-2P) ; off-sheet MIPI_DSI_TX1_D2P
MIPI_DSI_TX1_D3N: U90074.19(MIPI-3N) ; off-sheet MIPI_DSI_TX1_D3N
MIPI_DSI_TX1_D3P: U90074.20(MIPI-3P) ; off-sheet MIPI_DSI_TX1_D3P
MIPI_LCD_BL_2: R193.1 ; off-sheet MIPI_LCD_BL_2
MIPI_LCD_EN_2: R204.1 ; off-sheet MIPI_LCD_EN_2
MIPI_RESET_2: R194.1 ; off-sheet MIPI_RESET_2
TP_DET_1: R66.1 ; off-sheet TP_DET_1
TP_INT_1: RP1.7(R2) ; off-sheet TP_INT_1
TP_INT_LCD: D15.1 RP1.2(R2) U90074.25(TP-INT) ; off-sheet TP_INT_LCD
TP_RST_1: RP1.8(R1) ; off-sheet TP_RST_1
TP_RST_LCD: D16.1 RP1.1(R1) U90074.23(TP-RESET) ; off-sheet TP_RST_LCD
NetC159_1: C159.1 C160.1 FB5.2 L14.1 U34.7(IN)
NetC164_2: C164.2 R190.1 R193.2
NetC165_1: C165.1 Q13.2(SOURCE) R197.2 R198.2 R200.1
NetC165_2: C165.2 Q13.1(GATE) R200.2 R203.1
NetC173_1: C173.1 U35.4(BP)
NetD50_1: D50.1(A) L14.2 U34.4(LX1) U34.5(LX2)
NetQ6_1: Q6.1(GATE) R63.1 R66.2 R67.2
NetQ14_1: Q14.1(BASE) R204.2
NetQ14_3: Q14.3(COLLECTOR) R203.2
NetR187_2: R187.2 R191.2 U34.9(EN)
NetR188_1: R188.1 R190.2 U34.2(FB)
NetR194_2: R194.2 R195.1 U90074.4(RESET)
NetR205_2: R205.2 U35.3(EN)
NetR9210_2: R9210.2 R9211.2 U90074.2(IOVCC1V8-3V3)

Not connected (* = marked no-connect by the designer): U34 1(NC1) 3(NC2) 6(NC3) 10(NC4); U90074 3(4) 5(6) 36(37) 37(38)

### Notes on the sheet
- MIPI_LCD_TX1
- 3.3V
- LCD_TP
- (in symbol LCD39P_03) connect to 40P 0.5
- (in symbol radxa_1010) Size; Title:; REV; Page Name:; Date:; Sheet; of

### Library data of the parts
C52 C173 = CAP NP_0: as C131 on sheet 15; Dielectric: X5R; Part Type: C0402; Manufacturer PN: C1005X5R1C104K050BA; Created by: JJJ
  C52: Voltage: 16V
C54 = CAP NP_0: cap,10.00uF,+/-10%,10V,X5R,C0603; Manufacturer PN: C1608X5R1A106K080AC; Manufacturer: TDK; Tolerance: 10%; Priority: A; Dielectric: X5R; Created by: JJJ; Part Type: C0603; RK PN: C1608X5R1A106K080AC
C159 C167 C172 = CAP NP: CAP,MLCC,100nF,+/-10%,X7R,6.3V,SMD0402
C160 = CAP NP
C161 = CAP NP: RoHS CHIP CAP 1uF +10/-10% 25V X5R
C164 = CAP NP: RoHS CHIP CAP 0.1uF +10/-10% X7R
C165 = CAP NP_0: cap,100.00nF,+/-10%,6.3V,X5R,C0402; Manufacturer: TDK; RK PN: C1005X5R0J104K050BA; Priority: A; Tolerance: 10%; Dielectric: X5R; Part Type: C0402; Manufacturer PN: C1005X5R0J104K050BA; Created by: JJJ
C166 = CAP NP: CAP,MLCC,4.7uF,+/-10%,X5R,6.3V,SMD0603
C168 = CAP NP_0: cap,4.70uF,+/-10%,6.3V,X5R,C0603; Manufacturer: TDK; RK PN: C1608X5R0J475K080AB; Priority: A; Tolerance: 10%; Dielectric: X5R; Part Type: C0603; Manufacturer PN: C1608X5R0J475K080AB; Created by: JJJ
C169 = CAP NP_0: cap,4.70uF,+/-10%,10V,X5R,C0603; Manufacturer: TDK; RK PN: C1608X5R1A475K080AC; Priority: A; Tolerance: 10%; Dielectric: X5R; Part Type: C0603; Manufacturer PN: C1608X5R1A475K080AC; Created by: JJJ
C170 = CAP NP_0: cap,4.70uF,+/-10%,10V,X5R,C0603; Manufacturer PN: C1608X5R1A475K080AC; Manufacturer: TDK; Tolerance: 10%; Priority: A; Dielectric: X5R; Created by: JJJ; Part Type: C0603; RK PN: C1608X5R1A475K080AC
C171 = CAP NP_0: cap,10.00uF,+/-10%,10V,X5R,C0805; Manufacturer PN: C2012X5R1A106K125AB; Manufacturer: TDK; Tolerance: 10%; Priority: A; Dielectric: X5R; Created by: JJJ; Part Type: C0805; RK PN: C2012X5R1A106K125AB
D14 = DIODE BI_DIR TRIG_0: as D48 on sheet 16; Created by: JJJ; Part Type: ESD_TVS; RK PN: ESD5451N
D15-D17 = DIODE BI_DIR TRIG_0: as D49 on sheet 16; Part Type: ESD_TVS; Manufacturer PN: ESD5451N; Created by: JJJ
D50 = DIODE
FB5 R187 R190 R193-R195 = RES 1B: ROHS CHIP RES 4.7K 1/16W 5%
L14 = INDUCTORS OF FERRITE
Q6 = MOSFET P: PMOS,WPM2015-3/TR,SOT_23,Id=2.4A,Vds=20V; Manufacturer: WillSemi(韦尔半导体); ROOM: CHG; Priority: A; Id_max: 2.4A; Vgs: ±8V; VDS: 20V; Vgsth: 0.62V; Pd: 0.5W; option: DNP; RK PN: WPM2015-3/TR; Part Type: PMOS; Manufacturer PN: WPM2015-3/TR; Created by: JJJ
Q13 = MOSFET P_Dup1: PMOS,WPM2015-3/TR,SOT23,Id=2.4A,Vds=20V; Manufacturer: WillSemi(韦尔半导体); Pd: 0.5W; Vgsth: 0.62V; VDS: 20V; Vgs: ±8V; Id: 2.4A; Priority: A; Created by: JJJ; Manufacturer PN: WPM2015-3/TR; Part Type: PMOS; RK PN: WPM2015-3/TR
Q14 = NPN: S8050 SOT23; Manufacturer: 长电; Manufacturer PN: S8050_SOT23; Priority: A; Ic: 0.5A; Vceo: 25V; Pc: 0.3W; RK PN: S8050; Part Type: NPN; Created by: JJJ
R61 = RESISTOR_0: 通用厚膜电阻,0R,+/-5%,R0402,1/16W.; Manufacturer PN: RC0402JR-070RL; Manufacturer: YAGEO; Tolerance: 5%; Wattage: 1/16W; Priority: A; Created by: YTL; Part Type: 通用厚膜电阻; RK PN: RC0402JR-070RL
R63 R191 R203 R204 R9210 R9211 = RESISTOR_0: as R210 on sheet 14; Created by: YTL; Part Type: 通用厚膜电阻; RK PN: RC0402JR-0710KL
R66 = RESISTOR_0: as R156 on sheet 15; Part Type: 通用厚膜电阻; Manufacturer PN: RC0402JR-07100KL; Created by: YTL
R67 R205 = RESISTOR_0: as R152 on sheet 15; Part Type: 通用厚膜电阻; Manufacturer PN: RC0402JR-0710KL; Created by: YTL
R188 = RES 1B: ROHS CHIP RES 82K 1/16W 5%
R189 R192 R197 R198 = RES 1B: ROHS CHIP RES 4.7R 1/4W 5%
R200 = RESISTOR_0: as R158 on sheet 15; Created by: YTL; Part Type: 通用厚膜电阻; RK PN: RC0402JR-07100KL
RP1 = R-PACK4
U34 = MP3202-QFN8_1
U35 = LDO_PT5108: 500mA, Low Dropout, Low Noise Ultra-Fast Without Bypass Capacitor CMOS LDO Regulator; Manufacturer PN: RT9013-30GB; Manufacturer: Richtek（立錡）; Priority: A; RK PN: RT9013-30B; Option: /CE75B30M; Created by: JJJ; Part Type: LDO
*#19 = radxa_1010: Page Number: 20; Page Create Date: March  8, 1995